# EasyEDA Pro project ProPrj_3rdyearproject_2025-04-09.epro

# Schematic Schematic1
Board Name: Board1; Create Date: 2024-12-09; Page Name: P1; Project Name: FDA__TLC2274; Schematic Name: Schematic1; Update Date: 2024-12-09; Company: 嘉立创EDA; Page Size: A4; Version: V1.0
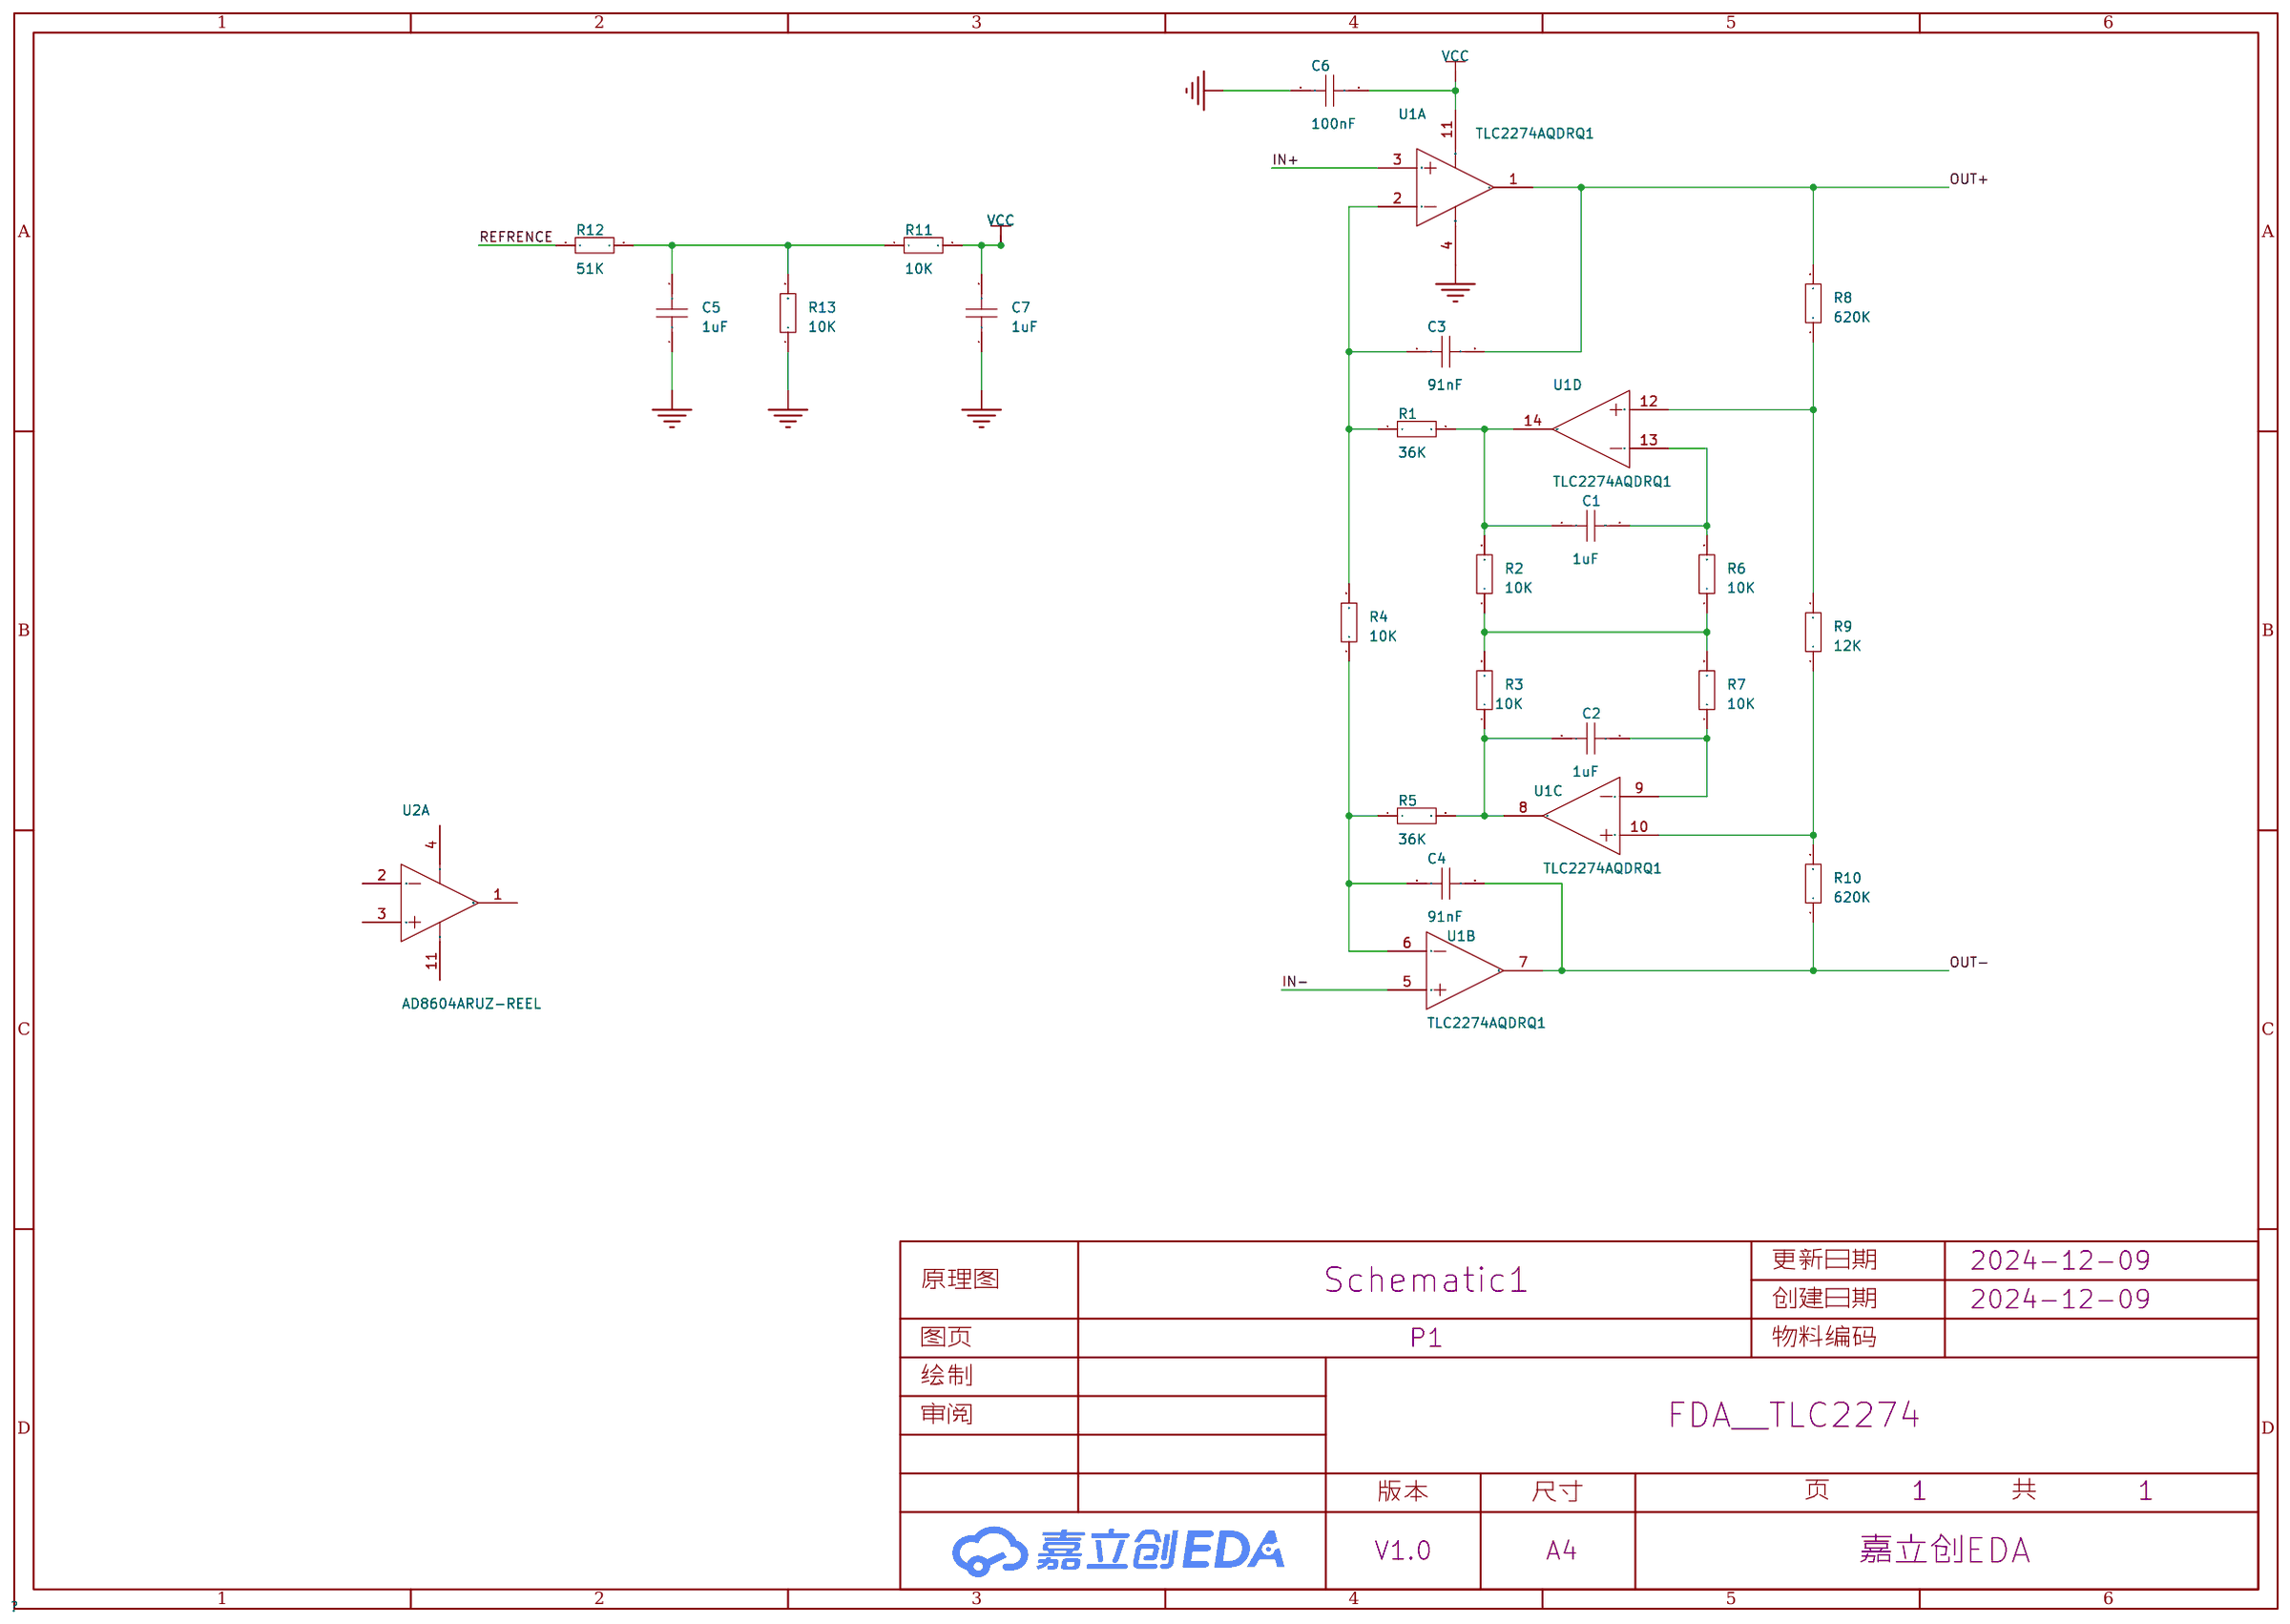
[diagram p0: schematic sheet]

## Parts
C1  1uF  [C0603]
C2  1uF  [C0603]
C3  91nF  [C0603]
C4  91nF  [C0603]
C5  1uF  [C0603]
C6  100nF  [C0603]
C7  1uF  [C0603]
R1  36K  [R0805]
R2  10K  [R0805]
R3  10K  [R0805]
R4  10K  [R0805]
R5  36K  [R0805]
R6  10K  [R0805]
R7  10K  [R0805]
R8  620K  [R0805]
R9  12K  [R0805]
R10  620K  [R0805]
R11  10K  [R0805]
R12  51K  [R0805]
R13  10K  [R0805]
U1  TLC2274AQDRQ1  [SOIC-14_L8.7-W3.9-P1.27-LS6.0-BL]  (sections 1,2,3,4)
U2  AD8604ARUZ-REEL  [TSSOP-14_L5.0-W4.4-P0.65-LS6.4-BL]  (section 1)

## Library data of the parts
C1-C7 = CAP_0805: Supplier Footprint: 0805
R1-R13 = Res_0805: Supplier Footprint: 0805
U1 = TLC2274AQDRQ1: 放大器数:四路;增益带宽积(GBP):2.25MHz;输入偏置电流(Ib):1pA;压摆率(SR):3.6V/us;带宽(-3db):-;轨到轨:-;; Supplier Part: C2872460; Manufacturer: TI(德州仪器); Supplier Footprint: SOIC-14; JLCPCB Part Class: 扩展库; Datasheet: https://www.ti.com/cn/lit/gpn/tlc2272-q1; Supplier: LCSC; Number of Circuits: 四路; Gain Bandwidth Product(GBP): 2.25MHz; Current - Input Bias(Ib): 1pA; Slew Rate(SR): 3.6V/us; Output Current: 50mA; Operating Temperature: -40℃~+125℃
U2 = AD8604ARUZ-REEL: 放大器数:四路;增益带宽积(GBP):8.4MHz;输入偏置电流(Ib):0.2pA;压摆率(SR):6V/us;轨到轨:-;; LCSC Part Name: 精密CMOS单电源轨到轨输入/输出宽带运算放大器; Supplier Part: C72090; Manufacturer: ADI(亚德诺); Supplier Footprint: TSSOP-14; JLCPCB Part Class: 扩展库; Datasheet: https://atta.szlcsc.com/upload/public/pdf/source/20200312/C495277_C85BE0C96AB93EE692A69ACEB5A97F57.pdf; Supplier: LCSC; Number of Circuits: 四路; Gain Bandwidth Product(GBP): 8.4MHz; Current - Input Bias(Ib): 0.2pA; Slew Rate(SR): 6V/us; Supply Voltage: 2.7V~5.5V; Output Current: 50mA; Operating Temperature: -40℃~+125℃

## Nets
GND: C5.1 C6.1 C7.1 R13.1 U1.4(VDD+)
VCC: C6.2 C7.2 R11.2 U1.11(VDD-)
IN+: U1.3(1IN+)
IN-: U1.5(2IN+)
OUT+: C3.2 R8.2 U1.1(1OUT)
OUT-: C4.2 R10.1 U1.7(2OUT)
REFRENCE: R12.1
Net-(C1-1): C1.1 R1.2 R2.2 U1.14(4OUT)
Net-(C1-2): C1.2 R6.2 U1.13(4IN-)
Net-(C2-1): C2.1 R3.1 R5.2 U1.8(3OUT)
Net-(C2-2): C2.2 R7.1 U1.9(3IN-)
Net-(C3-1): C3.1 R1.1 R4.2 U1.2(1IN-)
Net-(C4-1): C4.1 R4.1 R5.1 U1.6(2IN-)
Net-(C5-2): C5.2 R11.1 R12.2 R13.2
Net-(R2-1): R2.1 R3.2 R6.1 R7.2
Net-(R8-1): R8.1 R9.2 U1.12(4IN+)
Net-(R9-1): R9.1 R10.2 U1.10(3IN+)

Not connected (* = marked no-connect by the designer): U2 1(OUTA) 2(-INA) 3(+INA) 4(V+) 11(V-)

# Schematic Schematic2
Board Name: Board2; Create Date: 2024-12-09; Page Name: P1; Project Name: FDA__TLC2274; Schematic Name: Schematic2; Update Date: 2024-12-09; Company: 嘉立创EDA; Page Size: A4; Version: V1.0
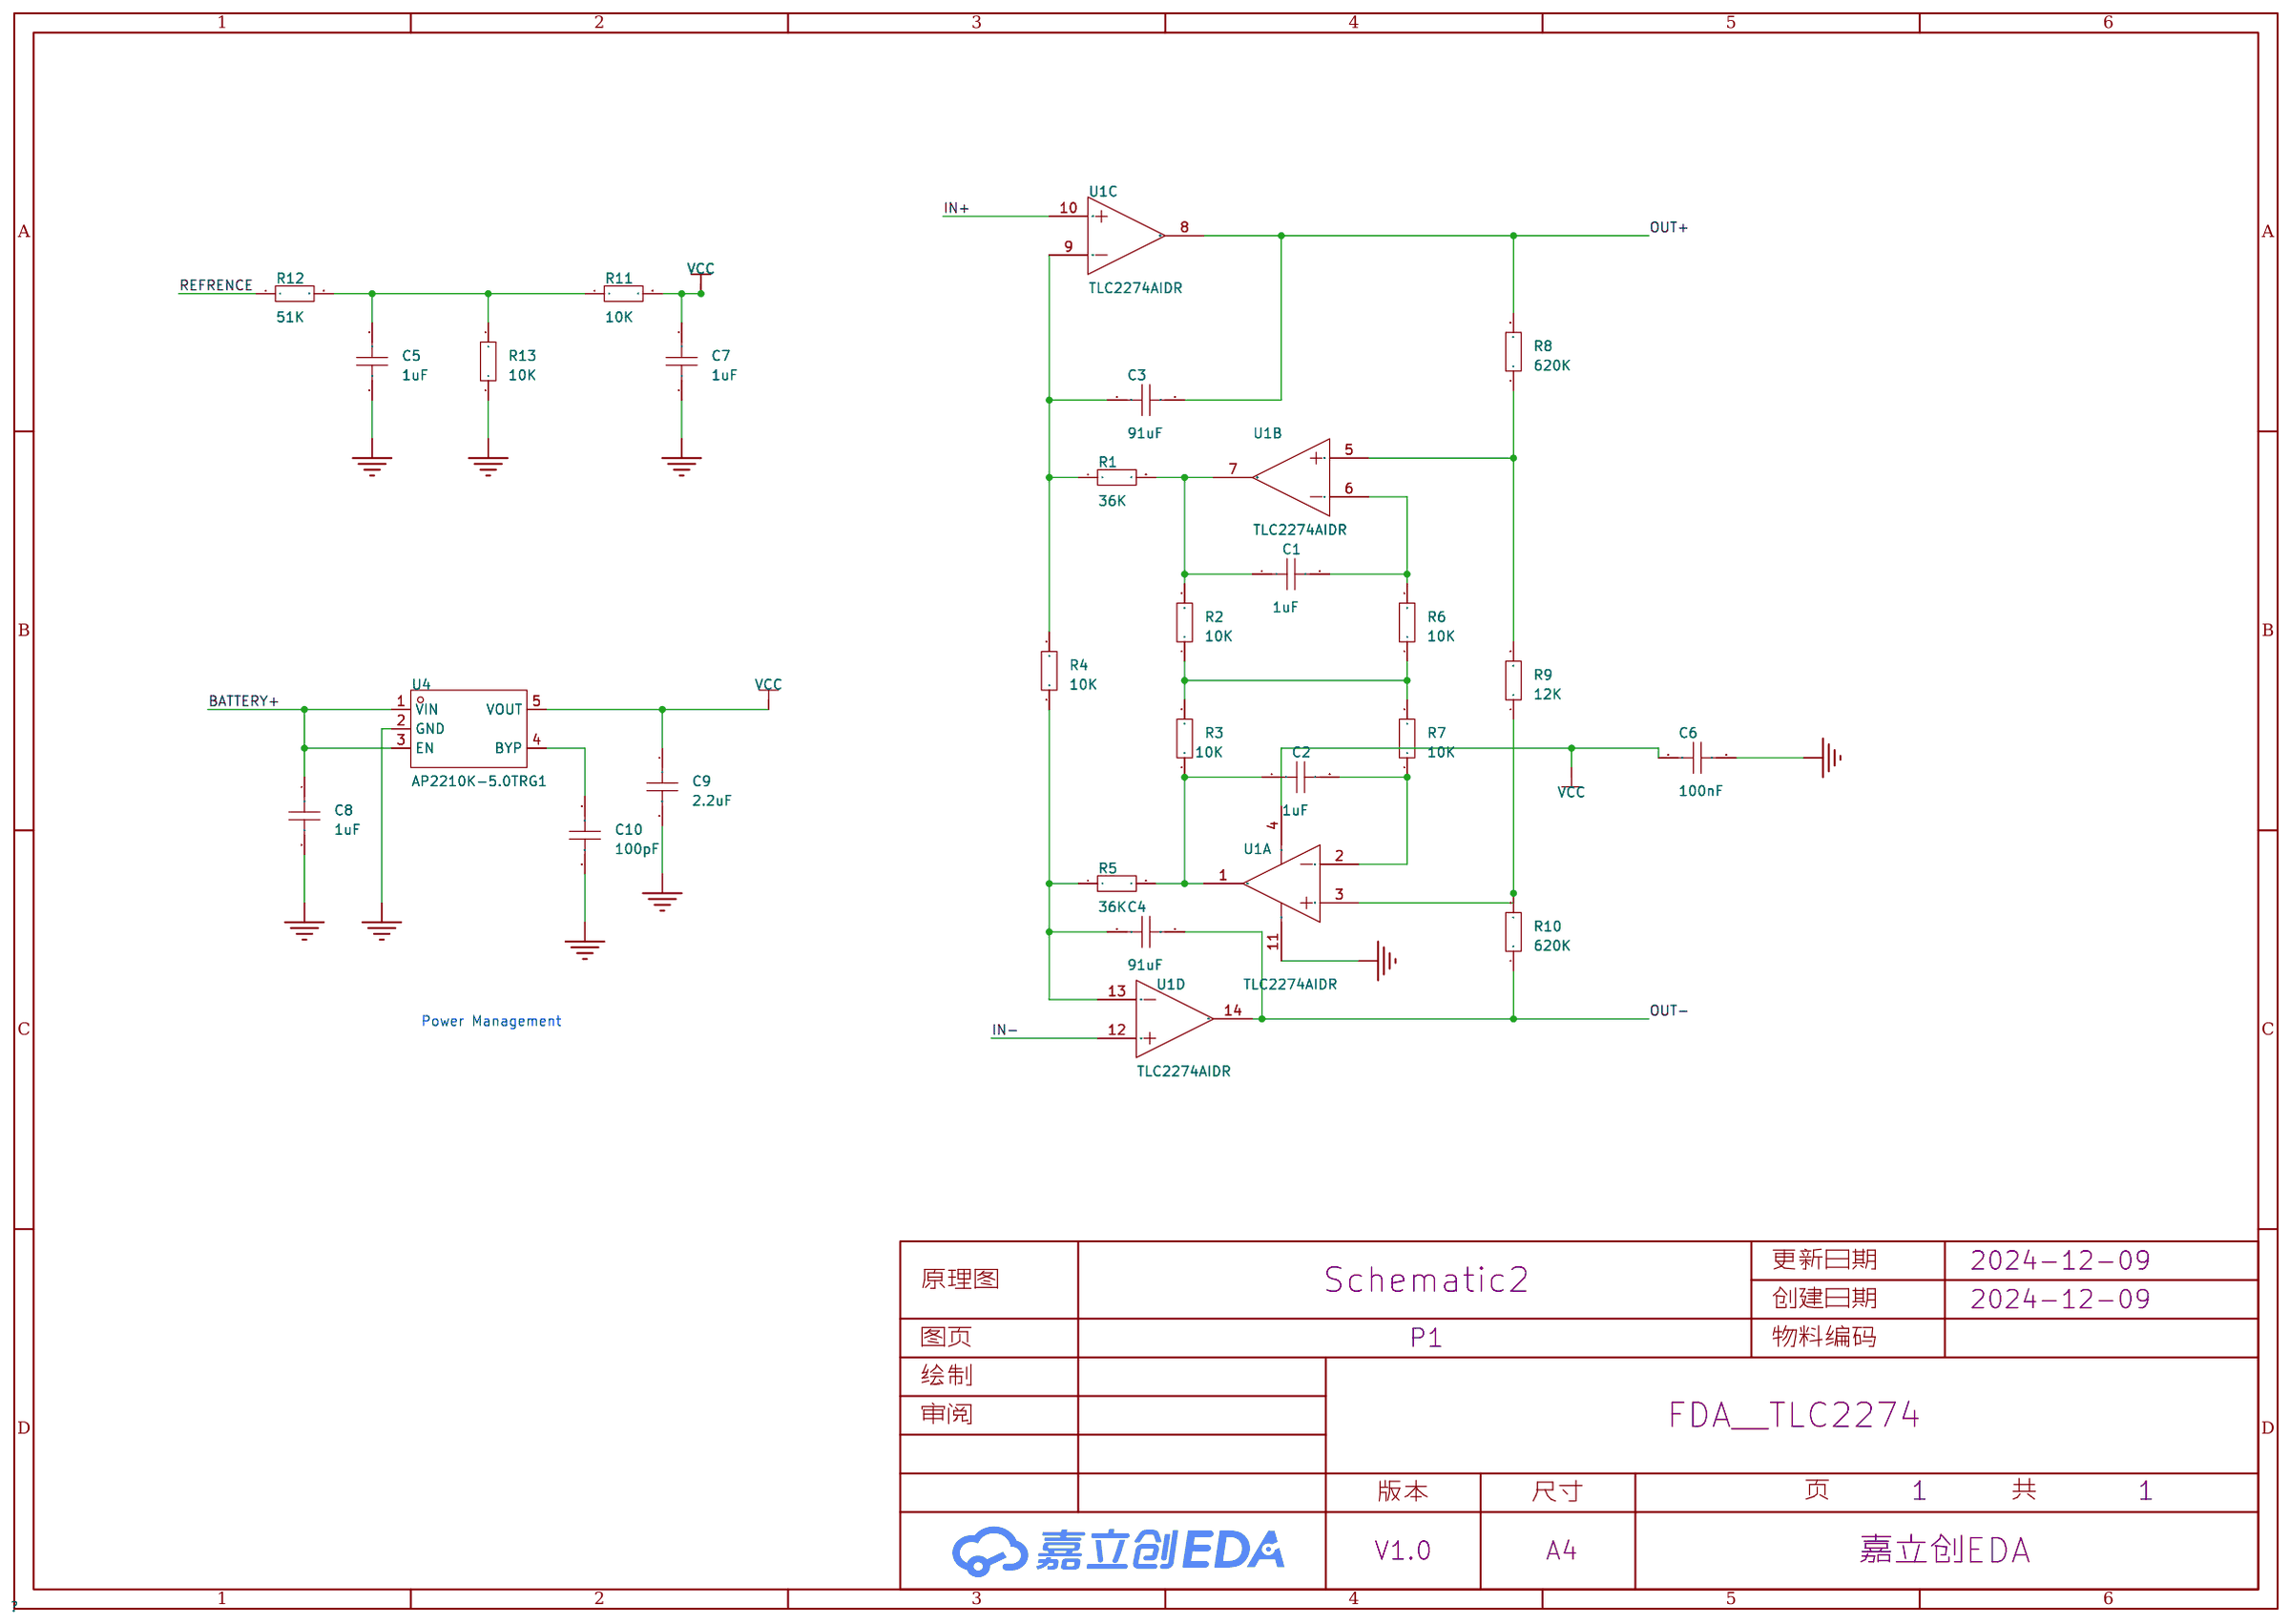
[diagram p1: schematic sheet]

## Parts
C1  1uF  [C0603]
C2  1uF  [C0603]
C3  91uF  [C0603]
C4  91uF  [C0603]
C5  1uF  [C0603]
C6  100nF  [C0603]
C7  1uF  [C0603]
C8  1uF  [C0603]
C9  2.2uF  [C0603]
C10  100pF  [C0603]
R1  36K  [R0805]
R2  10K  [R0805]
R3  10K  [R0805]
R4  10K  [R0805]
R5  36K  [R0805]
R6  10K  [R0805]
R7  10K  [R0805]
R8  620K  [R0805]
R9  12K  [R0805]
R10  620K  [R0805]
R11  10K  [R0805]
R12  51K  [R0805]
R13  10K  [R0805]
U1  TLC2274AIDR  [SOIC-14_L8.7-W3.9-P1.27-LS6.0-BL]  (sections 1,2,3,4)
U4  AP2210K-5.0TRG1  [SOT-23-5_L3.0-W1.7-P0.95-LS2.8-BR]

## Library data of the parts
C1-C7 = CAP_0805: Supplier Footprint: 0805
C8-C10 = CAP_0603: Supplier Footprint: 0603
R1-R13 = Res_0805: Supplier Footprint: 0805
U1 = TLC2274AIDR: 放大器数:四路;增益带宽积(GBP):2.25MHz;输入偏置电流(Ib):1pA;压摆率(SR):3.6V/us;轨到轨:-;; Supplier Part: C93026; Manufacturer: TI(德州仪器); Supplier Footprint: SOIC-14; JLCPCB Part Class: Extended Part; Datasheet: https://www.ti.com/cn/lit/gpn/tlc2274a; Supplier: LCSC; Number of Circuits: 四路; Gain Bandwidth Product(GBP): 2.25MHz; Current - Input Bias(Ib): 1pA; Slew Rate(SR): 3.6V/us; Output Current: 50mA; Supply Current: 4.8mA; Operating Temperature: -40℃~+125℃
U4 = AP2210K-5.0TRG1: 输出类型:固定;最大输入电压:13.2V;输出电压:5V;输出电流:300mA;电源纹波抑制比(PSRR):75dB@(100Hz);输出极性:正极;; LCSC Part Name: 300mA低噪声超低压差稳压器; Supplier Part: C500758; Manufacturer: DIODES(美台); Supplier Footprint: SOT-23-5; JLCPCB Part Class: 扩展库; Datasheet: https://atta.szlcsc.com/upload/public/pdf/source/20191127/C460341_CF25CCA109B05FF71BEEAE7A7BF43895.pdf; Supplier: LCSC; Output Type: 固定; Maximum Input Voltage: 13.2V; Output Voltage: 5V; Output Current: 300mA; Power Supply Rejection Ratio (PSRR): 75dB@(100Hz); Dropout Voltage: 500mV@(300mA); standby current: 180uA; Feature: 防静电保护；热保护(TSD)；过流保护(OCP)；带使能; Operating Temperature: -40℃~+125℃; Output Polarity: 正极; Number of Outputs: 1

## Nets
GND: C5.1 C6.1 C7.1 C8.2 C9.2 C10.2 R13.1 U1.11(VDD-) U4.2(GND)
VCC: C6.2 C7.2 C9.1 R11.2 U1.4(VDD+) U4.5(VOUT)
BATTERY+: C8.1 U4.1(VIN) U4.3(EN)
IN+: U1.10(3IN+)
IN-: U1.12(4IN+)
OUT+: C3.2 R8.2 U1.8(3OUT)
OUT-: C4.2 R10.1 U1.14(4OUT)
REFRENCE: R12.1
$1N804: C1.1 R1.2 R2.2 U1.7(2OUT)
$1N806: C2.2 R7.1 U1.2(1IN-)
$1N807: R9.1 R10.2 U1.3(1IN+)
$1N808: C3.1 R1.1 R4.2 U1.9(3IN-)
$1N809: C4.1 R4.1 R5.1 U1.13(4IN-)
$1N821: C5.2 R11.1 R12.2 R13.2
$1N827: R8.1 R9.2 U1.5(2IN+)
$1N828: C1.2 R6.2 U1.6(2IN-)
$1N830: R2.1 R3.2 R6.1 R7.2
$1N2912: C10.1 U4.4(BYP)
$1N3293: C2.1 R3.1 R5.2 U1.1(1OUT)

## Notes on the sheet
- Power Management

# Schematic Schematic7
Board Name: BAttery; Create Date: 2025-02-27; Page Name: P1; Project Name: FDA__TLC2274; Schematic Name: Schematic7; Update Date: 2025-02-27; Company: 嘉立创EDA; Page Size: A4; Version: V1.0
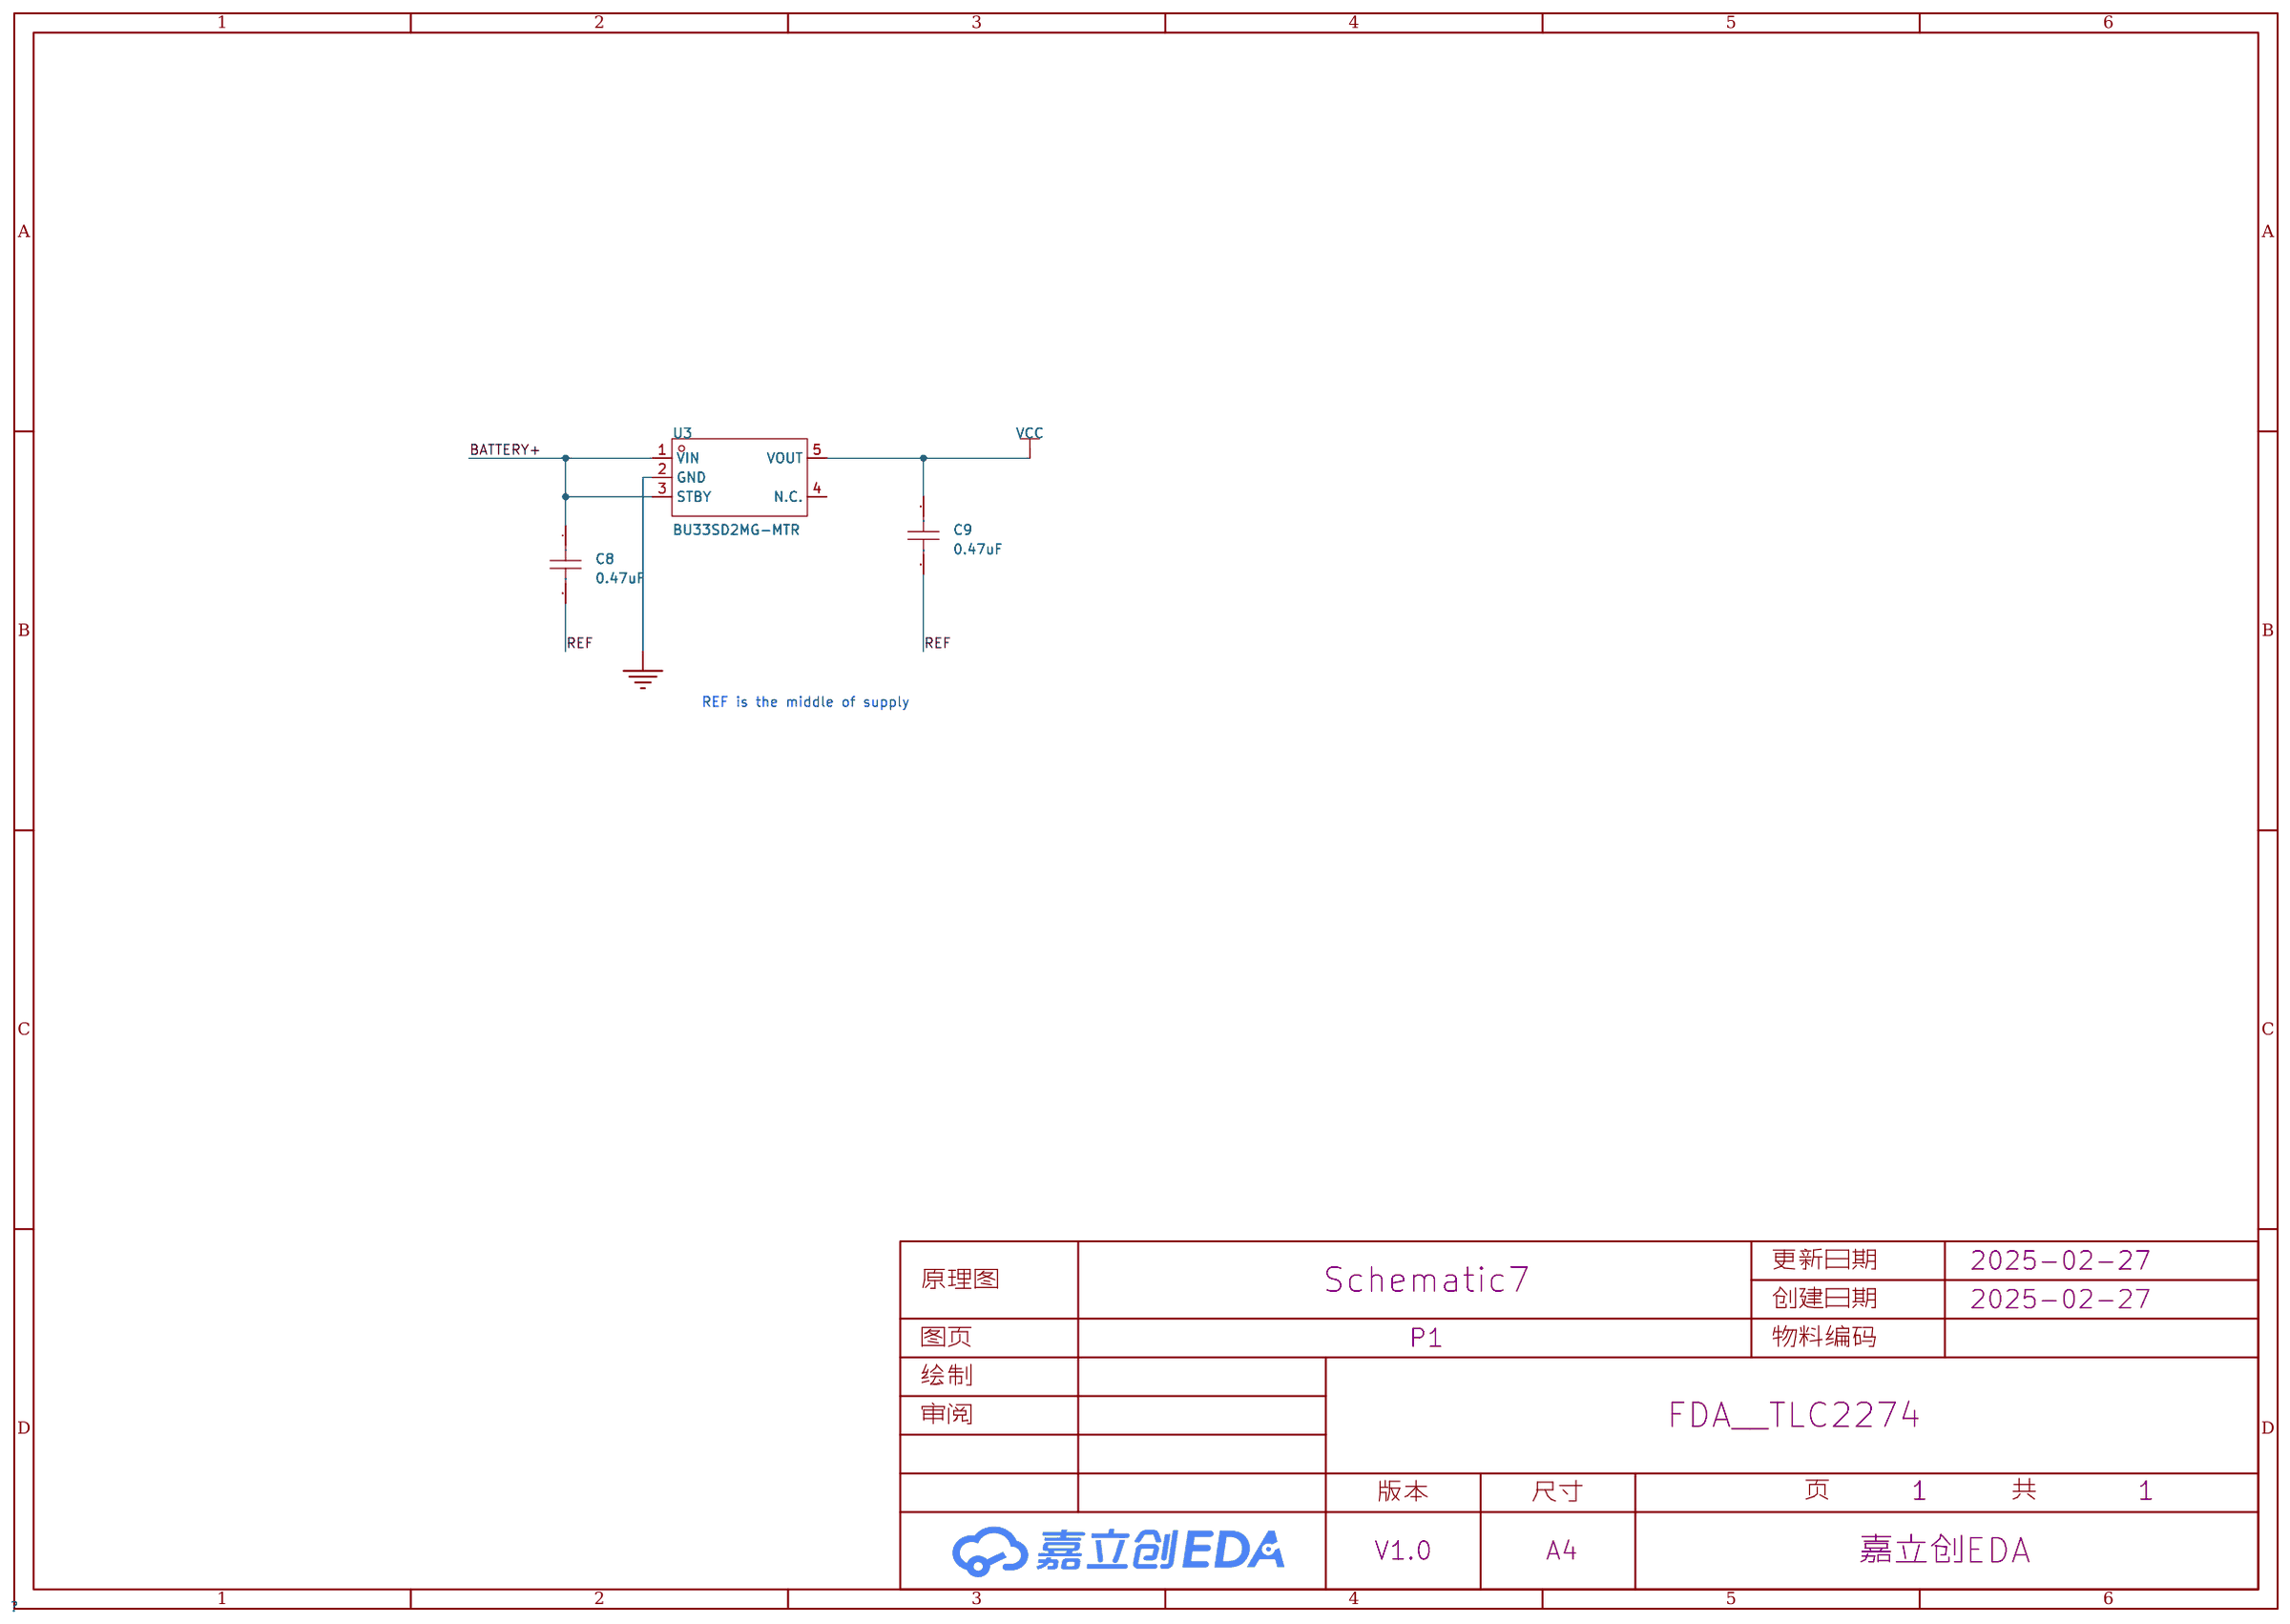
[diagram p2: schematic sheet]

## Parts
C8  0.47uF  [C0603]
C9  0.47uF  [C0603]
U3  BU33SD2MG-MTR  [SSOP-5_L3.0-W1.6-P0.95-LS2.8-TL]

## Library data of the parts
C8 C9 = CAP_0603: Supplier Footprint: 0603
U3 = BU33SD2MG-MTR: 输出类型:固定;最大输入电压:6V;输出电压:3.3V;输出电流:200mA;电源纹波抑制比(PSRR):68dB@(1kHz);输出极性:正极;; Supplier Part: C2984842; Manufacturer: ROHM(罗姆); Supplier Footprint: SSOP-5-1.6mm; JLCPCB Part Class: 扩展库; Datasheet: https://atta.szlcsc.com/upload/public/pdf/source/20220325/53F278B34F429D4C196077456C064AB8.pdf; Supplier: LCSC; Output Type: 固定; Maximum Input Voltage: 6V; Output Voltage: 3.3V; Output Current: 200mA; Power Supply Rejection Ratio (PSRR): 68dB@(1kHz); Feature: 车规认证；短路保护；低ESR；热保护(TSD)；过流保护(OCP)；带使能; Operating Temperature: -40℃~+105℃; Output Polarity: 正极; Number of Outputs: 1

## Nets
GND: U3.2(GND)
VCC: C9.1 U3.5(VOUT)
BATTERY+: C8.1 U3.1(VIN) U3.3(STBY)
REF: C8.2 C9.2

Not connected (* = marked no-connect by the designer): U3 4(N.C.)

## Notes on the sheet
- REF is the middle of supply

# Schematic DDA_1
Board Name: DD_final_Val; Create Date: 2025-02-27; Page Name: P1; Project Name: FDA__TLC2274; Schematic Name: DDA_1; Update Date: 2025-03-06; Company: 嘉立创EDA; Page Size: A4; Version: V1.0
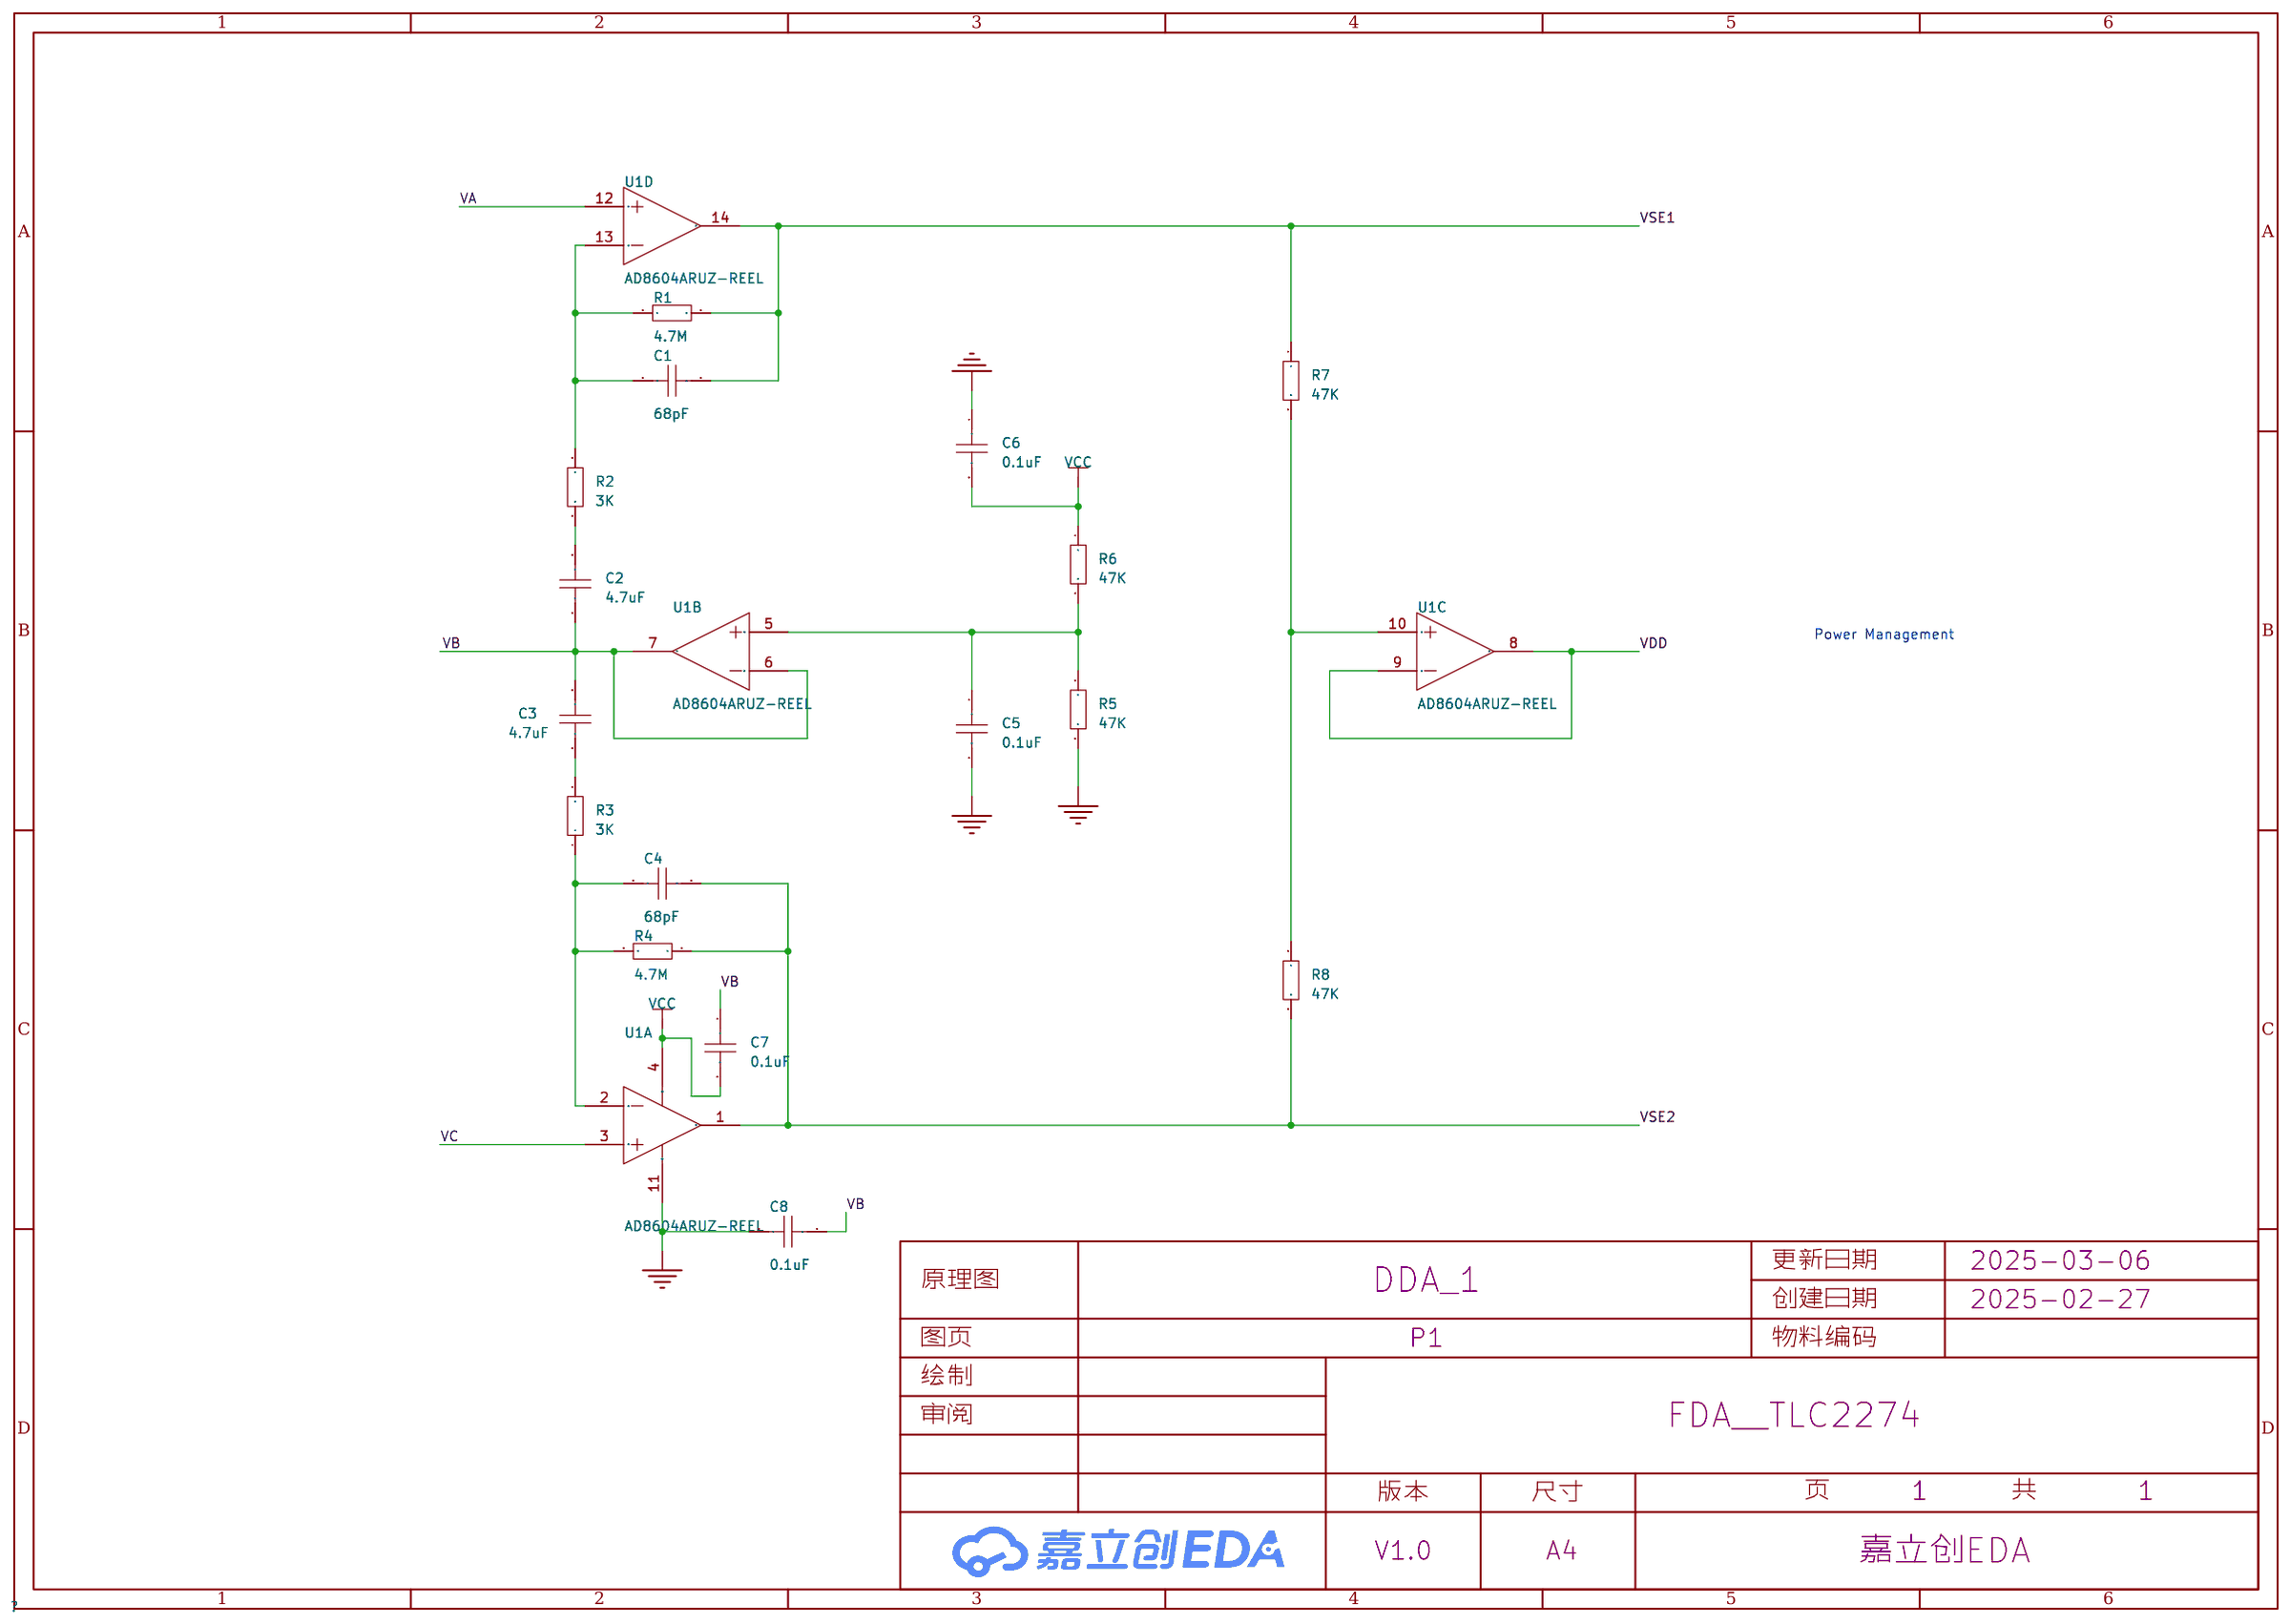
[diagram p3: schematic sheet]

## Parts
C1  68pF  [C0603]
C2  4.7uF  [C0603]
C3  4.7uF  [C0603]
C4  68pF  [C0603]
C5  0.1uF  [C0603]
C6  0.1uF  [C0603]
C7  0.1uF  [C0603]
C8  0.1uF  [C0603]
R1  4.7M  [R0805]
R2  3K  [R0805]
R3  3K  [R0805]
R4  4.7M  [R0805]
R5  47K  [R0805]
R6  47K  [R0805]
R7  47K  [R0805]
R8  47K  [R0805]
U1  AD8604ARUZ-REEL  [TSSOP-14_L5.0-W4.4-P0.65-LS6.4-BL]  (sections 1,2,3,4)

## Library data of the parts
C1-C8 = CAP_0603: Supplier Footprint: 0603
R1-R8 = Res_0805: Supplier Footprint: 0805
U1 = AD8604ARUZ-REEL: 放大器数:四路;增益带宽积(GBP):8.4MHz;输入偏置电流(Ib):0.2pA;压摆率(SR):6V/us;轨到轨:-;; LCSC Part Name: 精密CMOS单电源轨到轨输入/输出宽带运算放大器; Supplier Part: C72090; Manufacturer: ADI(亚德诺); Supplier Footprint: TSSOP-14; JLCPCB Part Class: Extended Part; Datasheet: https://atta.szlcsc.com/upload/public/pdf/source/20200312/C495277_C85BE0C96AB93EE692A69ACEB5A97F57.pdf; Supplier: LCSC; Number of Circuits: 四路; Gain Bandwidth Product(GBP): 8.4MHz; Current - Input Bias(Ib): 0.2pA; Slew Rate(SR): 6V/us; Supply Voltage: 2.7V~5.5V; Output Current: 50mA; Operating Temperature: -40℃~+125℃

## Nets
GND: C5.2 C6.1 C8.2 R5.2 U1.11(VDD-)
VCC: C6.2 C7.2 R6.1 U1.4(VDD+)
VDD: U1.8(OUT3) U1.9(IN3-)
VA: U1.12(IN4+)
VB: C2.1 C3.2 C7.1 C8.1 U1.6(IN2-) U1.7(OUT2)
VC: U1.3(IN1+)
VSE1: C1.2 R1.2 R7.1 U1.14(OUT4)
VSE2: C4.1 R4.1 R8.2 U1.1(OUT1)
$1N673: C2.2 R2.1
$1N676: C3.1 R3.2
$1N677: C1.1 R1.1 R2.2 U1.13(IN4-)
$1N680: C4.2 R3.1 R4.2 U1.2(IN1-)
$1N681: C5.1 R5.1 R6.2 U1.5(IN2+)
$1N688: R7.2 R8.1 U1.10(IN3+)

## Notes on the sheet
- Power Management

# Schematic SE
Board Name: SE_INA333; Create Date: 2025-01-22; Page Name: P1; Project Name: 毕设; Schematic Name: SE; Update Date: 2025-03-07; Company: 嘉立创EDA; Page Size: A4; Version: V1.0
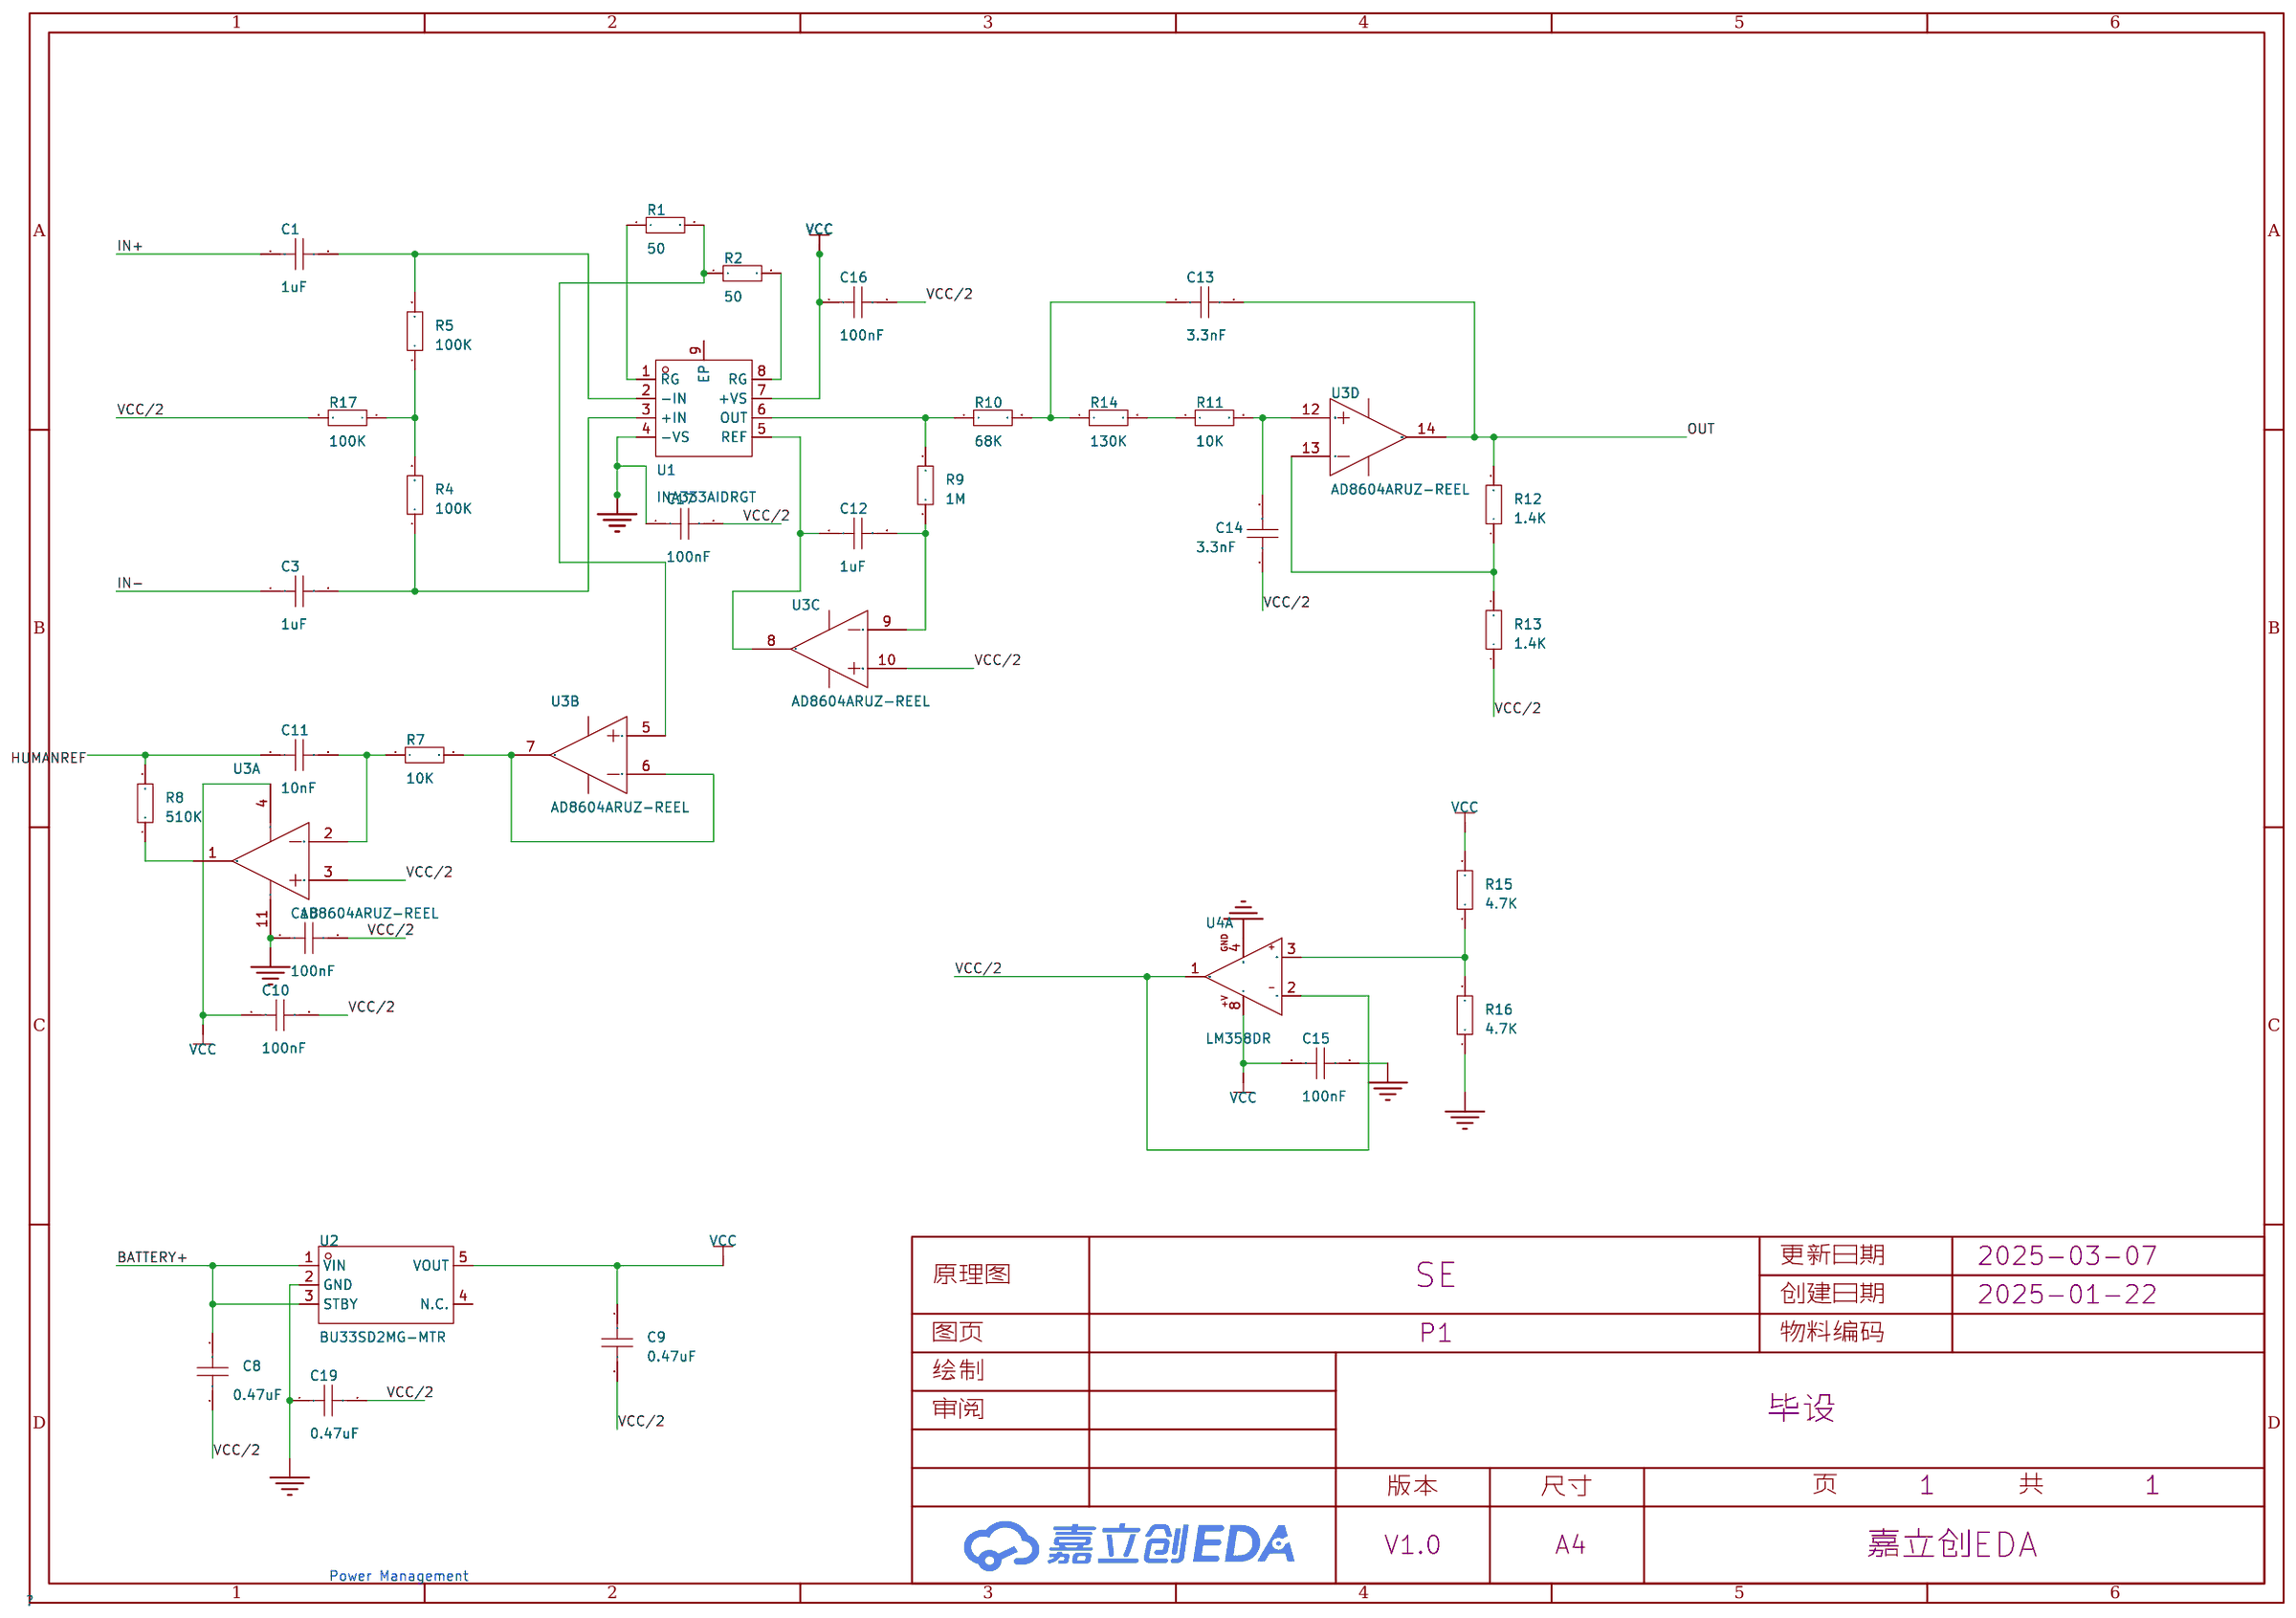
[diagram p4: schematic sheet]

## Parts
C1  1uF  [C0603]
C3  1uF  [C0603]
C8  0.47uF  [C0603]
C9  0.47uF  [C0603]
C10  100nF  [C0603]
C11  10nF  [C0603]
C12  1uF  [C0603]
C13  3.3nF  [C0603]
C14  3.3nF  [C0603]
C15  100nF  [C0603]
C16  100nF  [C0603]
C17  100nF  [C0603]
C18  100nF  [C0603]
C19  0.47uF  [C0603]
R1  50  [R0805]
R2  50  [R0805]
R4  100K  [R0805]
R5  100K  [R0805]
R7  10K  [R0805]
R8  510K  [R0805]
R9  1M  [R0805]
R10  68K  [R0805]
R11  10K  [R0805]
R12  1.4K  [R0805]
R13  1.4K  [R0805]
R14  130K  [R0805]
R15  4.7K  [R0805]
R16  4.7K  [R0805]
R17  100K  [R0805]
U1  INA333AIDRGT  [WSON-8_L3.0-W3.0-P0.50-TL-EP]
U2  BU33SD2MG-MTR  [SSOP-5_L3.0-W1.6-P0.95-LS2.8-TL]
U3  AD8604ARUZ-REEL  [TSSOP-14_L5.0-W4.4-P0.65-LS6.4-BL]  (sections 1,2,3,4)
U4  LM358DR  [SOIC-8_L5.0-W4.0-P1.27-LS6.0-BL]  (section 1)

## Library data of the parts
C1 C3 C8-C19 = CAP_0603: Supplier Footprint: 0603
R1 R2 R4 R5 R7-R17 = Res_0603: Supplier Footprint: 0603
U1 = INA333AIDRGT: 低功耗、零漂移、精密仪表放大器 8-SON -40 to 125; Supplier Part: C2871288; Manufacturer: TI(德州仪器); Supplier Footprint: WSON-8-EP(3x3); JLCPCB Part Class: 扩展库; Datasheet: https://www.ti.com/cn/lit/gpn/ina333; Supplier: LCSC
U2 = BU33SD2MG-MTR: 输出类型:固定;最大输入电压:6V;输出电压:3.3V;输出电流:200mA;电源纹波抑制比(PSRR):68dB@(1kHz);输出极性:正极;; Supplier Part: C2984842; Manufacturer: ROHM(罗姆); Supplier Footprint: SSOP-5-1.6mm; JLCPCB Part Class: 扩展库; Datasheet: https://atta.szlcsc.com/upload/public/pdf/source/20220325/53F278B34F429D4C196077456C064AB8.pdf; Supplier: LCSC; Output Type: 固定; Maximum Input Voltage: 6V; Output Voltage: 3.3V; Output Current: 200mA; Power Supply Rejection Ratio (PSRR): 68dB@(1kHz); Feature: 车规认证；短路保护；低ESR；热保护(TSD)；过流保护(OCP)；带使能; Operating Temperature: -40℃~+105℃; Output Polarity: 正极; Number of Outputs: 1
U3 = AD8604ARUZ-REEL: 放大器数:四路;增益带宽积(GBP):8.4MHz;输入偏置电流(Ib):0.2pA;压摆率(SR):6V/us;轨到轨:-;; LCSC Part Name: 精密CMOS单电源轨到轨输入/输出宽带运算放大器; Supplier Part: C72090; Manufacturer: ADI(亚德诺); Supplier Footprint: TSSOP-14; JLCPCB Part Class: 扩展库; Datasheet: https://atta.szlcsc.com/upload/public/pdf/source/20200312/C495277_C85BE0C96AB93EE692A69ACEB5A97F57.pdf; Supplier: LCSC; Number of Circuits: 四路; Gain Bandwidth Product(GBP): 8.4MHz; Current - Input Bias(Ib): 0.2pA; Slew Rate(SR): 6V/us; Supply Voltage: 2.7V~5.5V; Output Current: 50mA; Operating Temperature: -40℃~+125℃
U4 = LM358DR: 放大器数:双路;增益带宽积(GBP):700kHz;压摆率(SR):0.3V/us;输入偏置电流(Ib):20nA;; LCSC Part Name: 行业标准双路运算放大器; Supplier Part: C5423; Manufacturer: TI(德州仪器); Supplier Footprint: SOIC-8; JLCPCB Part Class: 扩展库; Datasheet: https://www.ti.com/cn/lit/gpn/lm358; Supplier: LCSC; Number of Circuits: 双路; Gain Bandwidth Product(GBP): 700kHz; Slew Rate(SR): 0.3V/us; Current - Input Bias(Ib): 20nA; Quiescent Current: 1mA; Output Current: 40mA; Operating Temperature: 0℃~+70℃

## Nets
GND: C15.2 C17.1 C18.1 C19.1 R16.1 U1.4(-VS) U2.2(GND) U3.11(V-) U4.4(GND)
VCC: C9.1 C10.1 C15.1 C16.1 R15.2 U1.7(+VS) U2.5(VOUT) U3.4(V+) U4.8(+V)
BATTERY+: C8.1 U2.1(VIN) U2.3(STBY)
HUMANREF: C11.1 R8.2
IN+: C1.1
IN-: C3.1
OUT: C13.2 R12.2 U3.14(OUTD)
VCC/2: C8.2 C9.2 C10.2 C14.1 C16.2 C17.2 C18.2 C19.2 R13.1 R17.2 U3.3(+INA) U3.10(+INC) U4.1(OUT1) U4.2(-IN1)
$1N347: C1.2 R5.2 U1.2(-IN)
$1N842: R2.2 U1.8(RG)
$1N847: R1.2 R2.1 U3.5(+INB)
$1N852: R1.1 U1.1(RG)
$1N1234: R7.2 U3.6(-INB) U3.7(OUTB)
$1N1350: C11.2 R7.1 U3.2(-INA)
$1N1355: R8.1 U3.1(OUTA)
$1N1538: C12.2 R9.1 U3.9(-INC)
$1N1639: R9.2 R10.1 U1.6(OUT)
$1N1648: C12.1 U1.5(REF) U3.8(OUTC)
$1N1862: C13.1 R10.2 R14.1
$1N1878: C14.2 R11.2 U3.12(+IND)
$1N1894: R12.1 R13.2 U3.13(-IND)
$1N1993: R11.1 R14.2
$1N2276: R15.1 R16.2 U4.3(+IN1)
$1N3297: R4.2 R5.1 R17.1
$1N3339: C3.2 R4.1 U1.3(+IN)

Not connected (* = marked no-connect by the designer): U1 9(EP); U2 4(N.C.)

## Notes on the sheet
- Power Management

# Schematic FDA
Board Name: FDA_AD8604; Create Date: 2025-01-13; Page Name: P1; Project Name: 毕设; Schematic Name: FDA; Update Date: 2025-01-28; Company: 嘉立创EDA; Page Size: A4; Version: V1.0
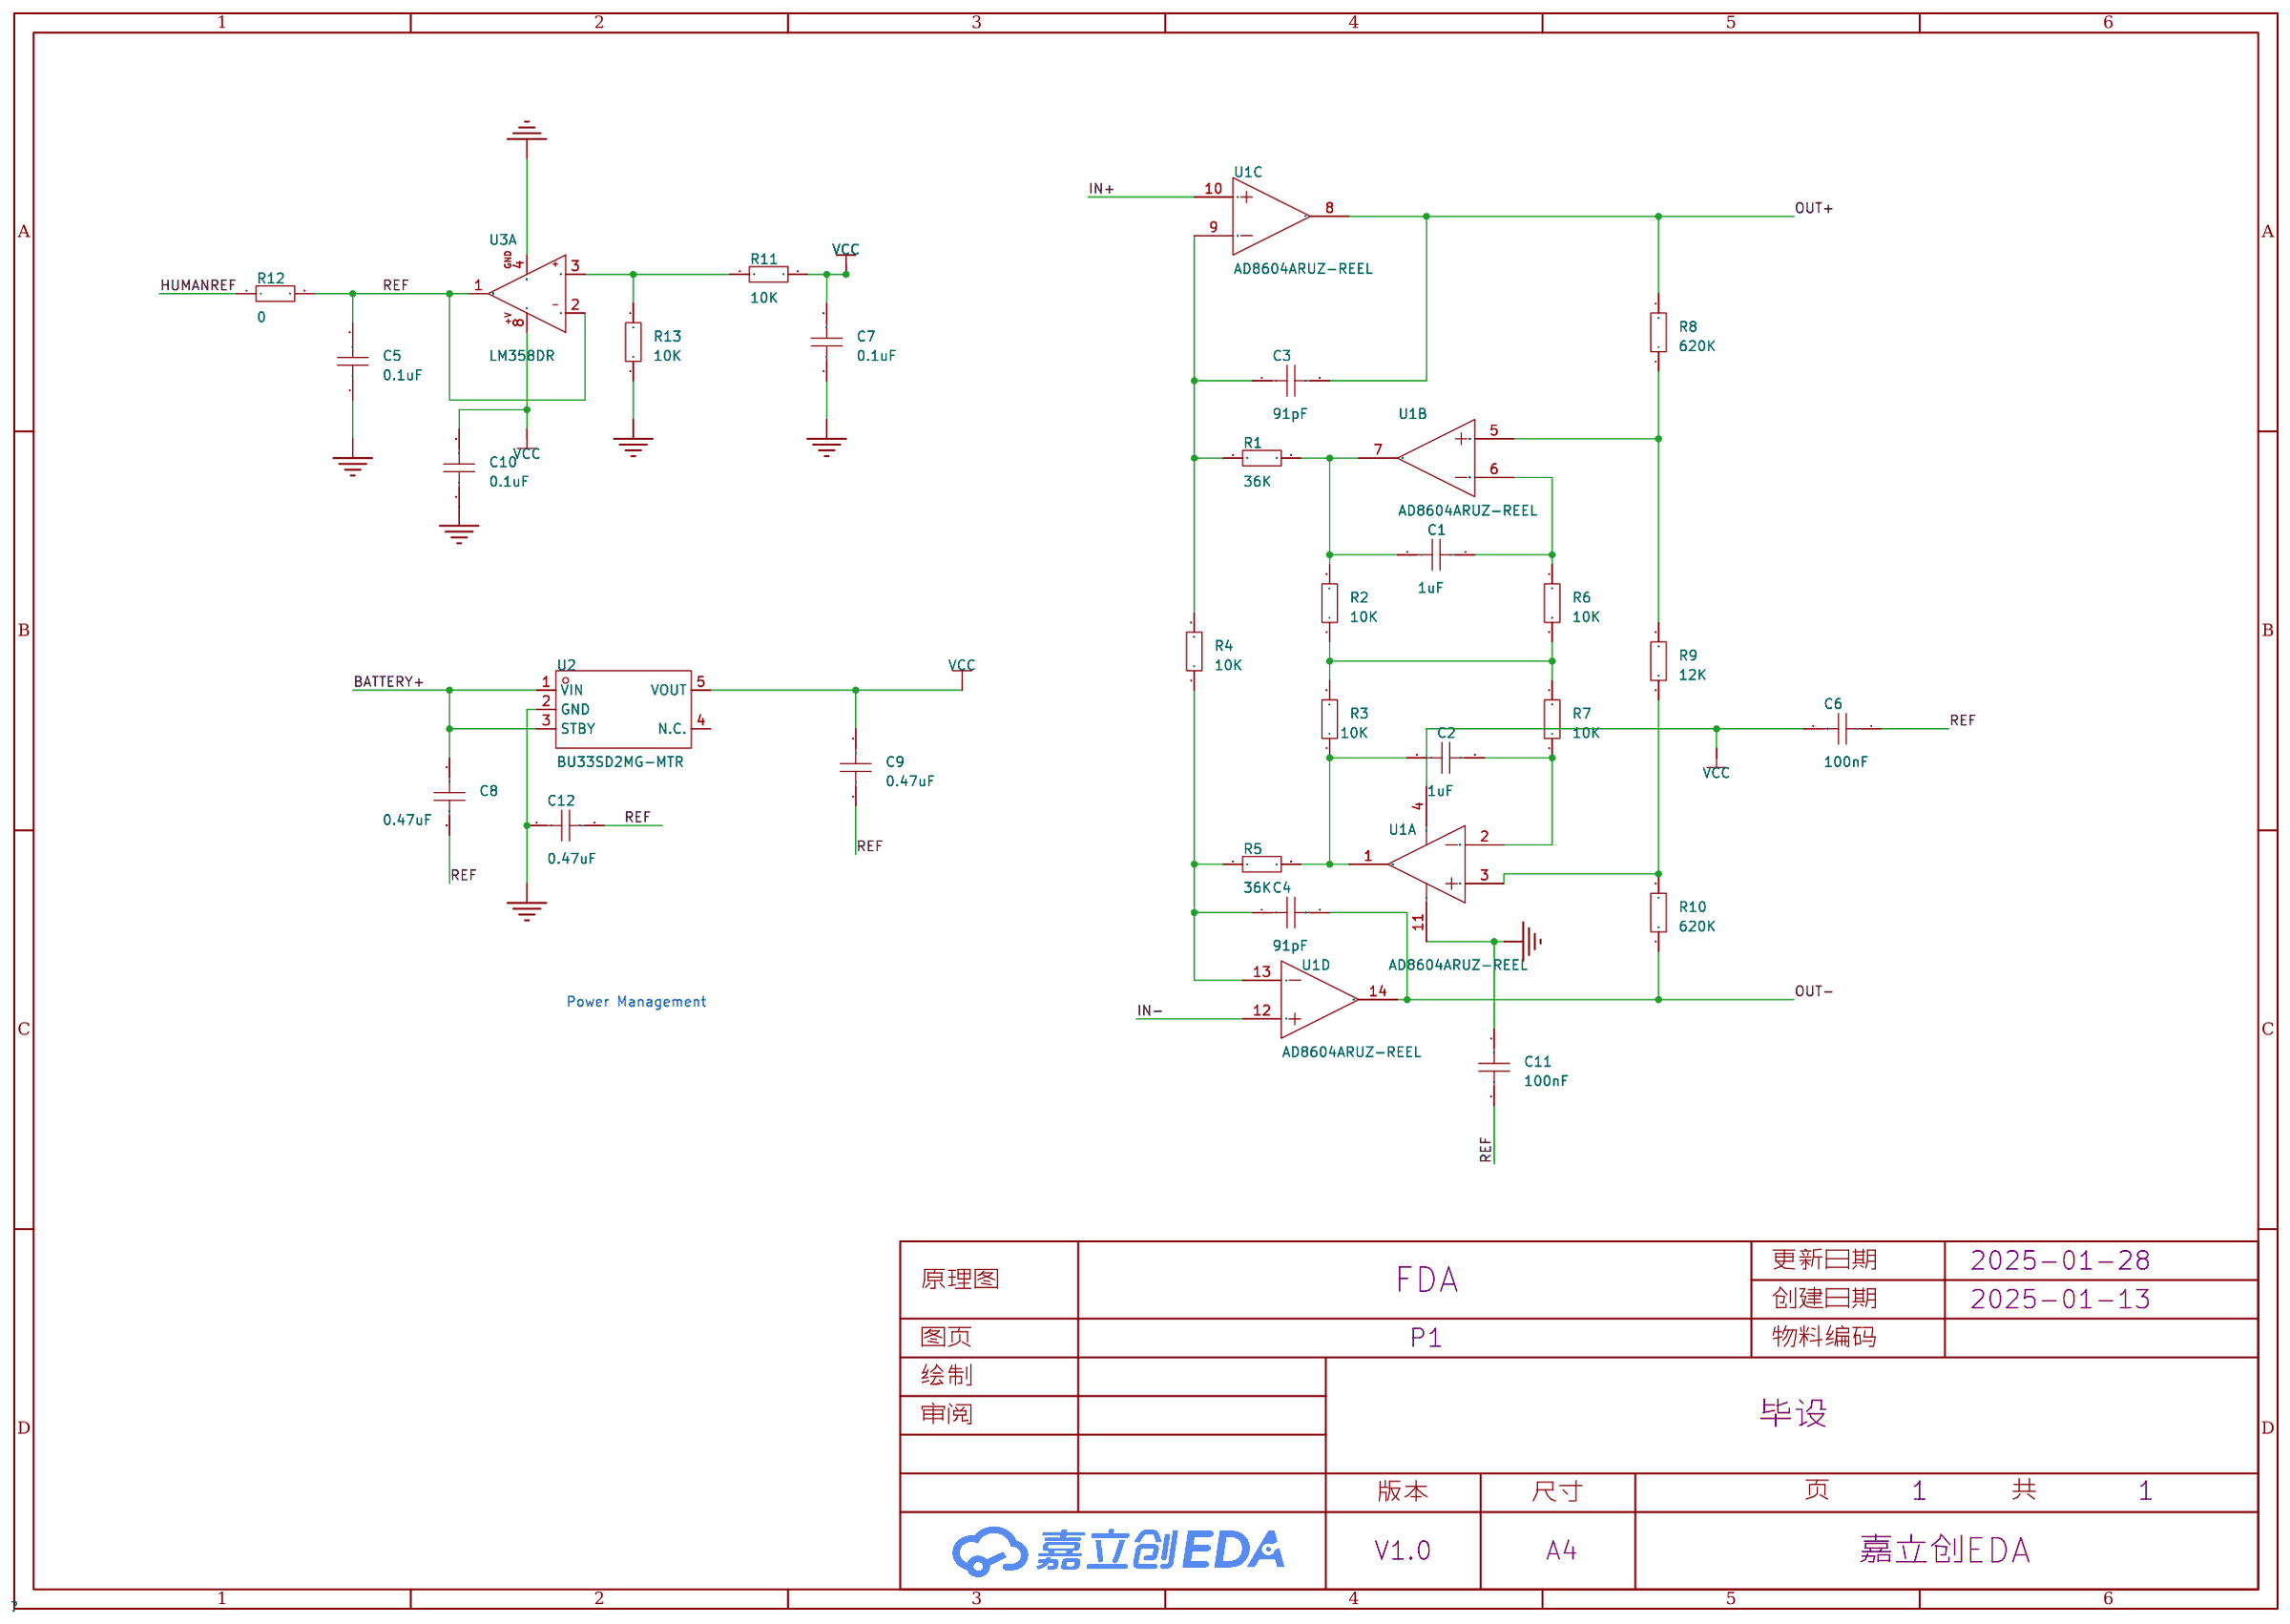
[diagram p5: schematic sheet]

## Parts
C1  1uF  [C0603]
C2  1uF  [C0603]
C3  91pF  [C0603]
C4  91pF  [C0603]
C5  0.1uF  [C0603]
C6  100nF  [C0603]
C7  0.1uF  [C0603]
C8  0.47uF  [C0603]
C9  0.47uF  [C0603]
C10  0.1uF  [C0603]
C11  100nF  [C0603]
C12  0.47uF  [C0603]
R1  36K  [R0805]
R2  10K  [R0805]
R3  10K  [R0805]
R4  10K  [R0805]
R5  36K  [R0805]
R6  10K  [R0805]
R7  10K  [R0805]
R8  620K  [R0805]
R9  12K  [R0805]
R10  620K  [R0805]
R11  10K  [R0805]
R12  0  [R0805]
R13  10K  [R0805]
U1  AD8604ARUZ-REEL  [TSSOP-14_L5.0-W4.4-P0.65-LS6.4-BL]  (sections 1,2,3,4)
U2  BU33SD2MG-MTR  [SSOP-5_L3.0-W1.6-P0.95-LS2.8-TL]
U3  LM358DR  [SOIC-8_L5.0-W4.0-P1.27-LS6.0-BL]  (section 1)

## Library data of the parts
C1-C7 C10 C11 = CAP_0805: Supplier Footprint: 0805
C8 C9 C12 = CAP_0603: Supplier Footprint: 0603
R1-R13 = Res_0805: Supplier Footprint: 0805
U1 = AD8604ARUZ-REEL: 放大器数:四路;增益带宽积(GBP):8.4MHz;输入偏置电流(Ib):0.2pA;压摆率(SR):6V/us;轨到轨:-;; LCSC Part Name: 精密CMOS单电源轨到轨输入/输出宽带运算放大器; Supplier Part: C72090; Manufacturer: ADI(亚德诺); Supplier Footprint: TSSOP-14; JLCPCB Part Class: Extended Part; Datasheet: https://atta.szlcsc.com/upload/public/pdf/source/20200312/C495277_C85BE0C96AB93EE692A69ACEB5A97F57.pdf; Supplier: LCSC; Number of Circuits: 四路; Gain Bandwidth Product(GBP): 8.4MHz; Current - Input Bias(Ib): 0.2pA; Slew Rate(SR): 6V/us; Supply Voltage: 2.7V~5.5V; Output Current: 50mA; Operating Temperature: -40℃~+125℃
U2 = BU33SD2MG-MTR: 输出类型:固定;最大输入电压:6V;输出电压:3.3V;输出电流:200mA;电源纹波抑制比(PSRR):68dB@(1kHz);输出极性:正极;; Supplier Part: C2984842; Manufacturer: ROHM(罗姆); Supplier Footprint: SSOP-5-1.6mm; JLCPCB Part Class: 扩展库; Datasheet: https://atta.szlcsc.com/upload/public/pdf/source/20220325/53F278B34F429D4C196077456C064AB8.pdf; Supplier: LCSC; Output Type: 固定; Maximum Input Voltage: 6V; Output Voltage: 3.3V; Output Current: 200mA; Power Supply Rejection Ratio (PSRR): 68dB@(1kHz); Feature: 车规认证；短路保护；低ESR；热保护(TSD)；过流保护(OCP)；带使能; Operating Temperature: -40℃~+105℃; Output Polarity: 正极; Number of Outputs: 1
U3 = LM358DR: 放大器数:双路;增益带宽积(GBP):700kHz;压摆率(SR):0.3V/us;输入偏置电流(Ib):20nA;; LCSC Part Name: 行业标准双路运算放大器; Supplier Part: C5423; Manufacturer: TI(德州仪器); Supplier Footprint: SOIC-8; JLCPCB Part Class: 扩展库; Datasheet: https://www.ti.com/cn/lit/gpn/lm358; Supplier: LCSC; Number of Circuits: 双路; Gain Bandwidth Product(GBP): 700kHz; Slew Rate(SR): 0.3V/us; Current - Input Bias(Ib): 20nA; Quiescent Current: 1mA; Output Current: 40mA; Operating Temperature: 0℃~+70℃

## Nets
GND: C5.1 C7.1 C10.1 C11.1 C12.1 R13.1 U1.11(VDD-) U2.2(GND) U3.4(GND)
VCC: C6.2 C7.2 C9.1 C10.2 R11.2 U1.4(VDD+) U2.5(VOUT) U3.8(+V)
BATTERY+: C8.1 U2.1(VIN) U2.3(STBY)
HUMANREF: R12.1
IN+: U1.10(3IN+)
IN-: U1.12(4IN+)
OUT+: C3.2 R8.2 U1.8(3OUT)
OUT-: C4.2 R10.1 U1.14(4OUT)
REF: C5.2 C6.1 C8.2 C9.2 C11.2 C12.2 R12.2 U3.1(OUT1) U3.2(-IN1)
$1N990: C1.1 R1.2 R2.2 U1.7(2OUT)
$1N991: C2.2 R7.1 U1.2(1IN-)
$1N992: R9.1 R10.2 U1.3(1IN+)
$1N993: C3.1 R1.1 R4.2 U1.9(3IN-)
$1N994: C4.1 R4.1 R5.1 U1.13(4IN-)
$1N1010: R8.1 R9.2 U1.5(2IN+)
$1N1011: C1.2 R6.2 U1.6(2IN-)
$1N1013: R2.1 R3.2 R6.1 R7.2
$1N1024: C2.1 R3.1 R5.2 U1.1(1OUT)
$1N2923: R11.1 R13.2 U3.3(+IN1)

Not connected (* = marked no-connect by the designer): U2 4(N.C.)

## Notes on the sheet
- Power Management

# Schematic Schematic10
Board Name: potentialdivider; Create Date: 2025-03-07; Page Name: P1; Project Name: 毕设; Schematic Name: Schematic10; Update Date: 2025-03-07; Company: 嘉立创EDA; Page Size: A4; Version: V1.0
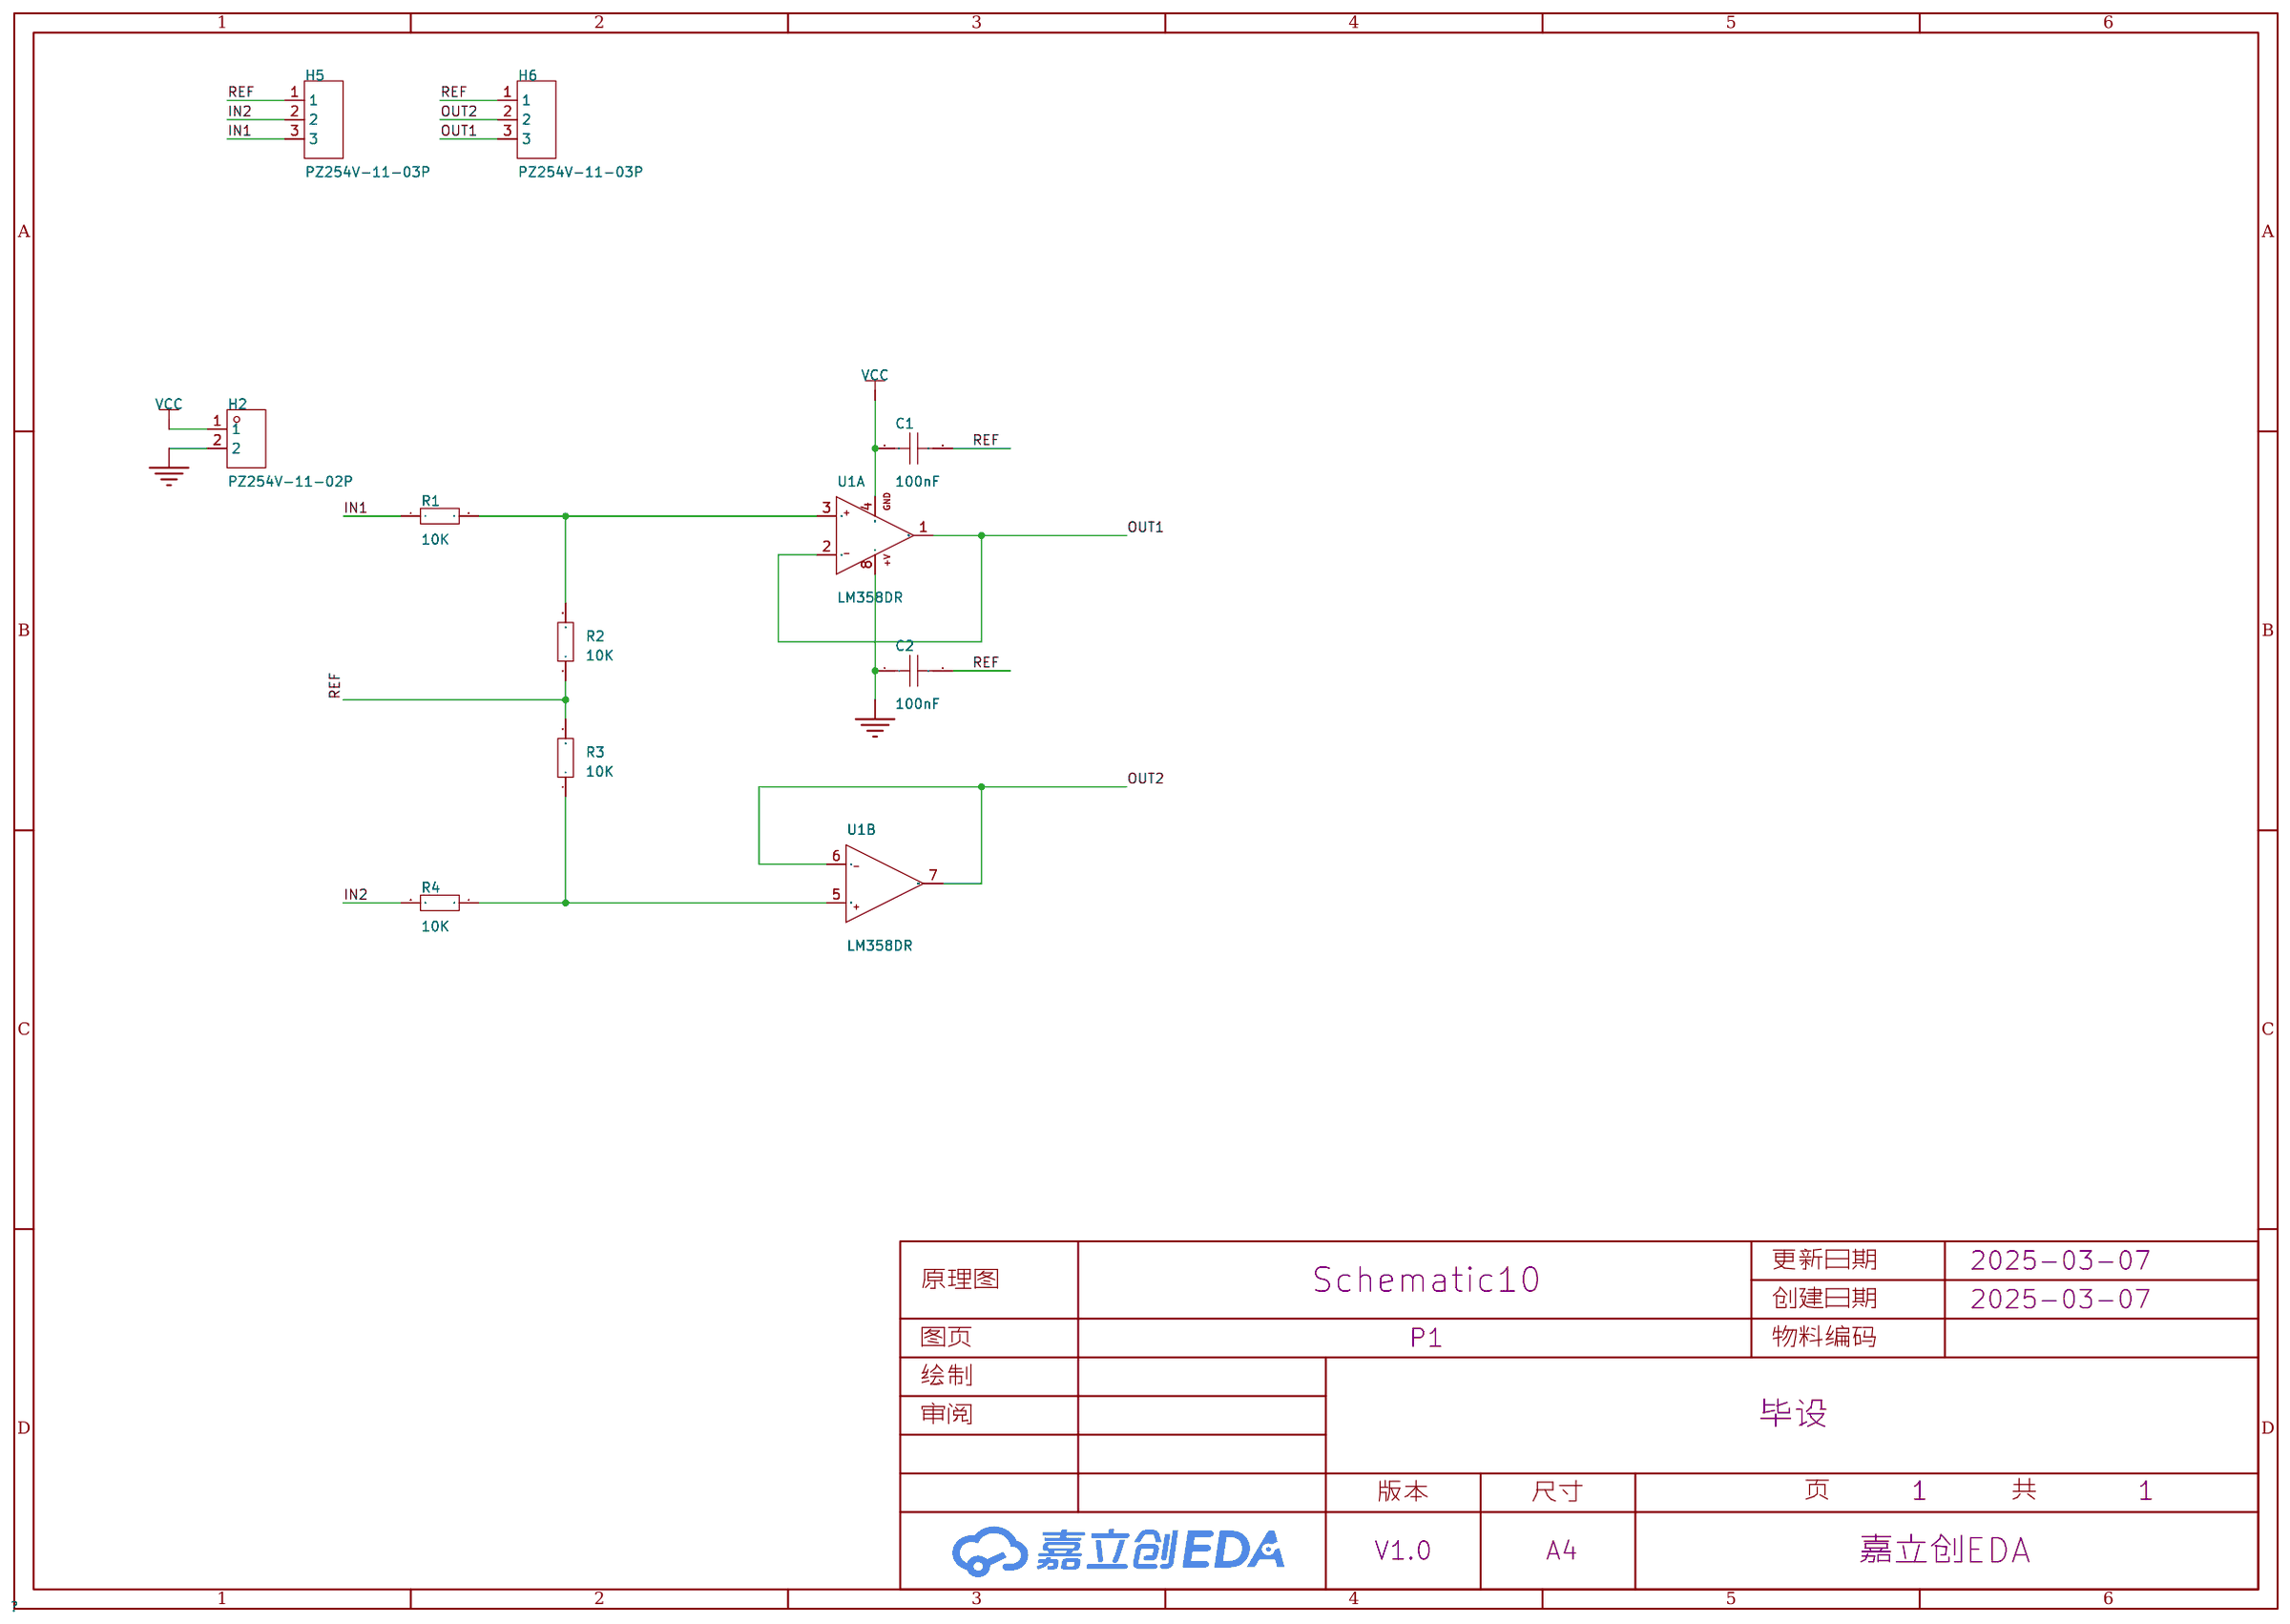
[diagram p6: schematic sheet]

## Parts
C1  100nF  [C0603]
C2  100nF  [C0603]
H2  PZ254V-11-02P  [HDR-TH_2P-P2.54-V-M]
H5  PZ254V-11-03P  [HDR-TH_3P-P2.54-V-M]
H6  PZ254V-11-03P  [HDR-TH_3P-P2.54-V-M]
R1  10K  [R0603]
R2  10K  [R0603]
R3  10K  [R0603]
R4  10K  [R0603]
U1  LM358DR  [SOIC-8_L5.0-W4.0-P1.27-LS6.0-BL]  (sections 1,2)

## Library data of the parts
C1 C2 = CAP_0603: Supplier Footprint: 0603
H2 = PZ254V-11-02P: 插针结构:1x2P;间距:2.54mm;行距:-;圆针/方针:方针;安装类型:直插;排数:单排;总PIN位数:2P;额定电流:-;额定电压:-;配合针长度:6mm;塑高:2.5mm;端接针长度:3mm;触头材质:黄铜;触头镀层:-;工作温度范围:-40℃~+105℃;颜色:黑色;; LCSC Part Name: 间距:2.54mm 1x2P 直插 方针; Supplier Part: C492401; Manufacturer: XFCN(兴飞); Supplier Footprint: 插件,P=2.54mm; JLCPCB Part Class: 扩展库; Datasheet: https://atta.szlcsc.com/upload/public/pdf/source/20200309/C492401_A812433581A9B211A7FFA413ADDFF0E5.pdf; Supplier: LCSC; Pin Structure: 1x2P; Pitch: 2.54mm; Circluar Pins/Square Pins: 方针; Mounting Type: 直插; Number of Rows: 单排; Number of Pins: 2P; Length of Mating Pin: 6mm; Insulation Height: 2.5mm; Length of End Connection Pin: 3mm; Contact Material: 黄铜; Operating Temperature Range: -40℃~+105℃; Color: 黑色
H5 H6 = PZ254V-11-03P: 插针结构:1x3P;间距:2.54mm;行距:-;圆针/方针:方针;安装方式:直插;排数:单排;总PIN位数:3P;额定电流:3A;额定电压:250V;配合针长度:6mm;塑高:2.5mm;端接针长度:3mm;工作温度:-40℃~+105℃;颜色:黑色;; LCSC Part Name: 1x3P 间距:2.54mm 方针 直插; Supplier Part: C2937625; Manufacturer: XFCN(兴飞); Supplier Footprint: 插件,P=2.54mm; JLCPCB Part Class: 扩展库; Datasheet: https://atta.szlcsc.com/upload/public/pdf/source/20200309/C492402_8335C3D49C4E4C618838D59BB1D024C1.pdf; Supplier: LCSC; Pin Structure: 1x3P; Pitch: 2.54mm; Circluar Pins/Square Pins: 方针; Mounting Type: 直插; Number of Rows: 单排; Number of Pins: 3P; Current Rating: 3A; Voltage Rating (Max): 250V; Length of Mating Pin: 6mm; Insulation Height: 2.5mm; Length of End Connection Pin: 3mm; Operating Temperature: -40℃~+105℃; Color: 黑色
R1-R4 = Res_0603: Supplier Footprint: 0603
U1 = LM358DR: 放大器数:双路;增益带宽积(GBP):700kHz;压摆率(SR):0.3V/us;输入偏置电流(Ib):20nA;; LCSC Part Name: 行业标准双路运算放大器; Supplier Part: C5423; Manufacturer: TI(德州仪器); Supplier Footprint: SOIC-8; JLCPCB Part Class: 扩展库; Datasheet: https://www.ti.com/cn/lit/gpn/lm358; Supplier: LCSC; Number of Circuits: 双路; Gain Bandwidth Product(GBP): 700kHz; Slew Rate(SR): 0.3V/us; Current - Input Bias(Ib): 20nA; Quiescent Current: 1mA; Output Current: 40mA; Operating Temperature: 0℃~+70℃

## Nets
GND: C2.1 H2.2 U1.8(+V)
VCC: C1.1 H2.1 U1.4(GND)
IN1: H5.3 R1.1
IN2: H5.2 R4.2
OUT1: H6.3 U1.1(OUT1) U1.2(-IN1)
OUT2: H6.2 U1.6(-IN2) U1.7(OUT2)
REF: C1.2 C2.2 H5.1 H6.1 R2.1 R3.2
$1N341: R1.2 R2.2 U1.3(+IN1)
$1N346: R3.1 R4.1 U1.5(+IN2)
